# Altium project B9_HashBoard.PrjPcb (part 1 of 2)
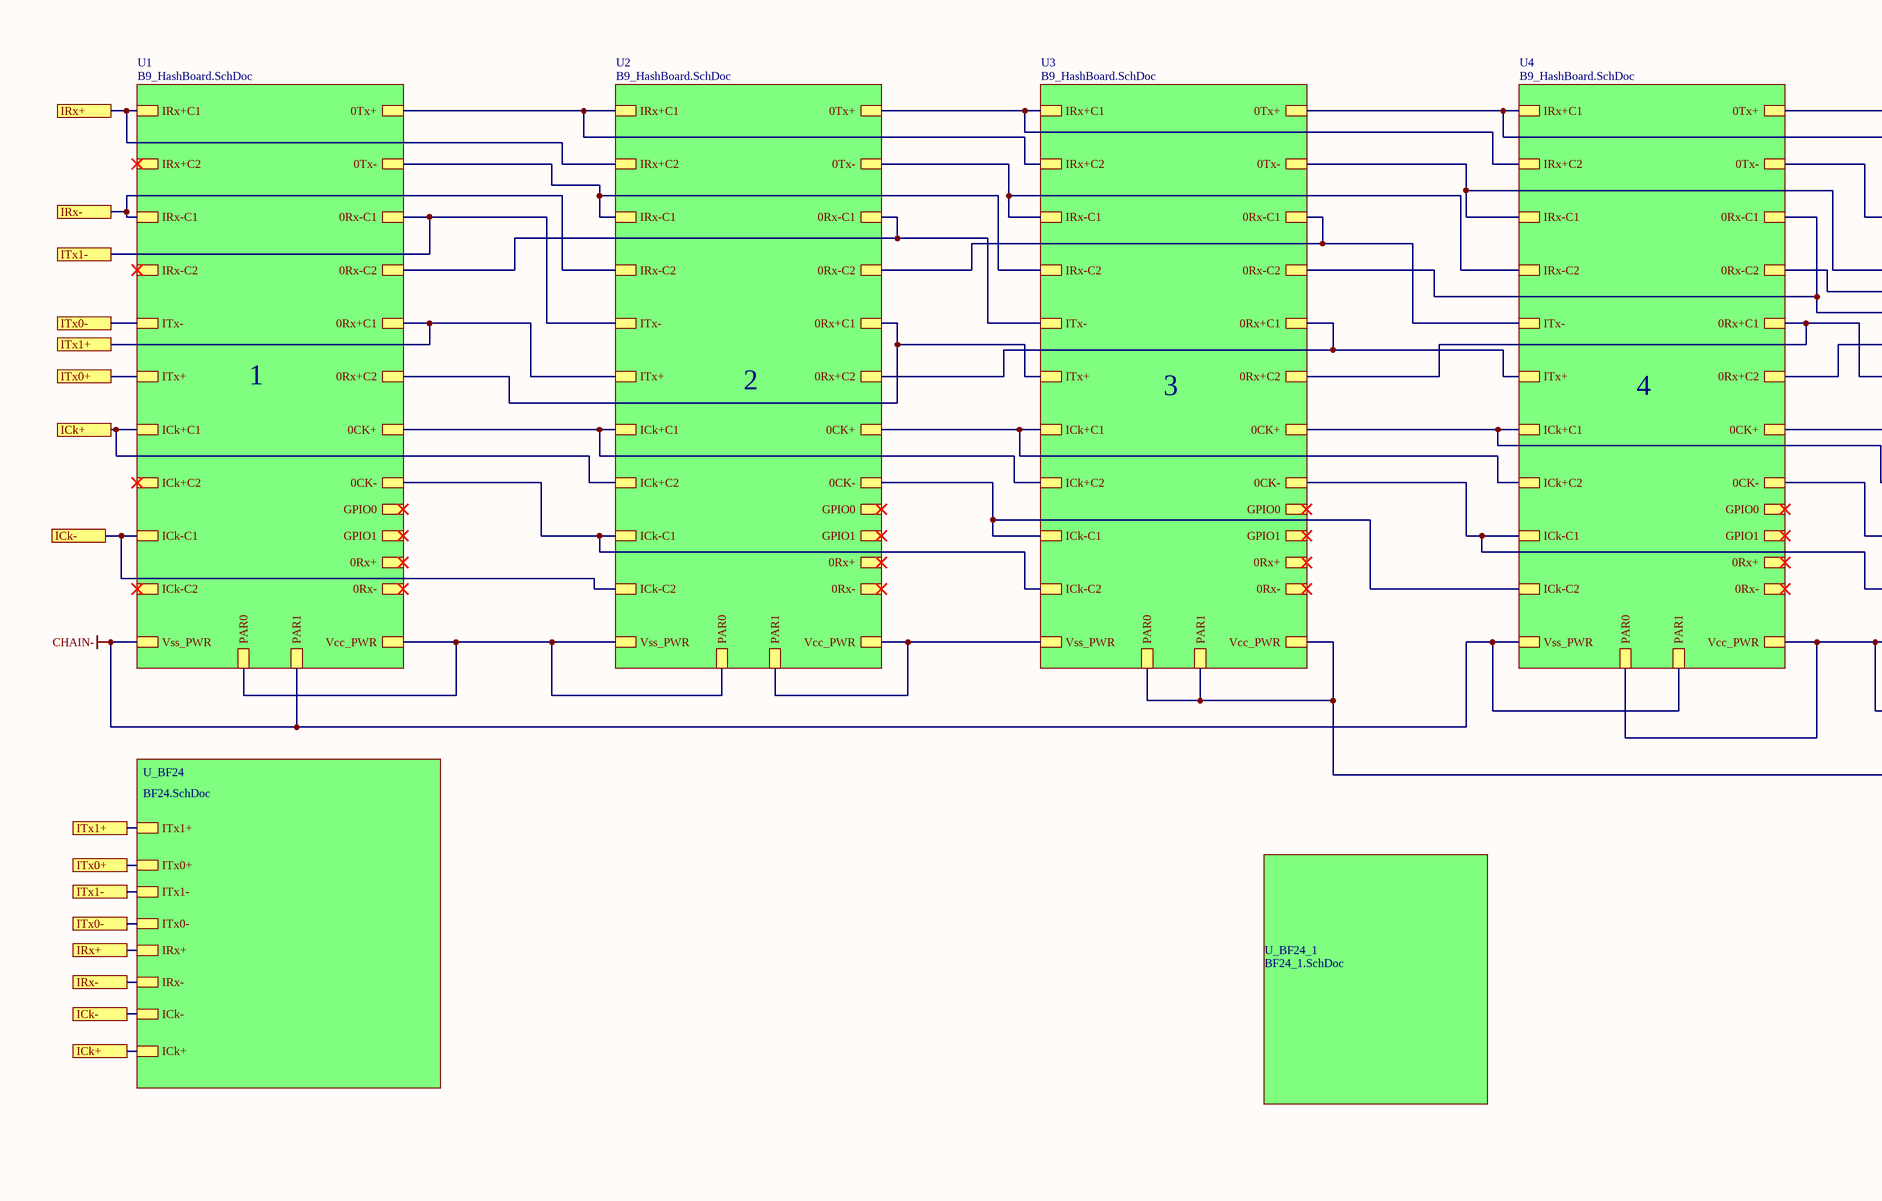
[diagram p0: Chain.SchDoc, top left]
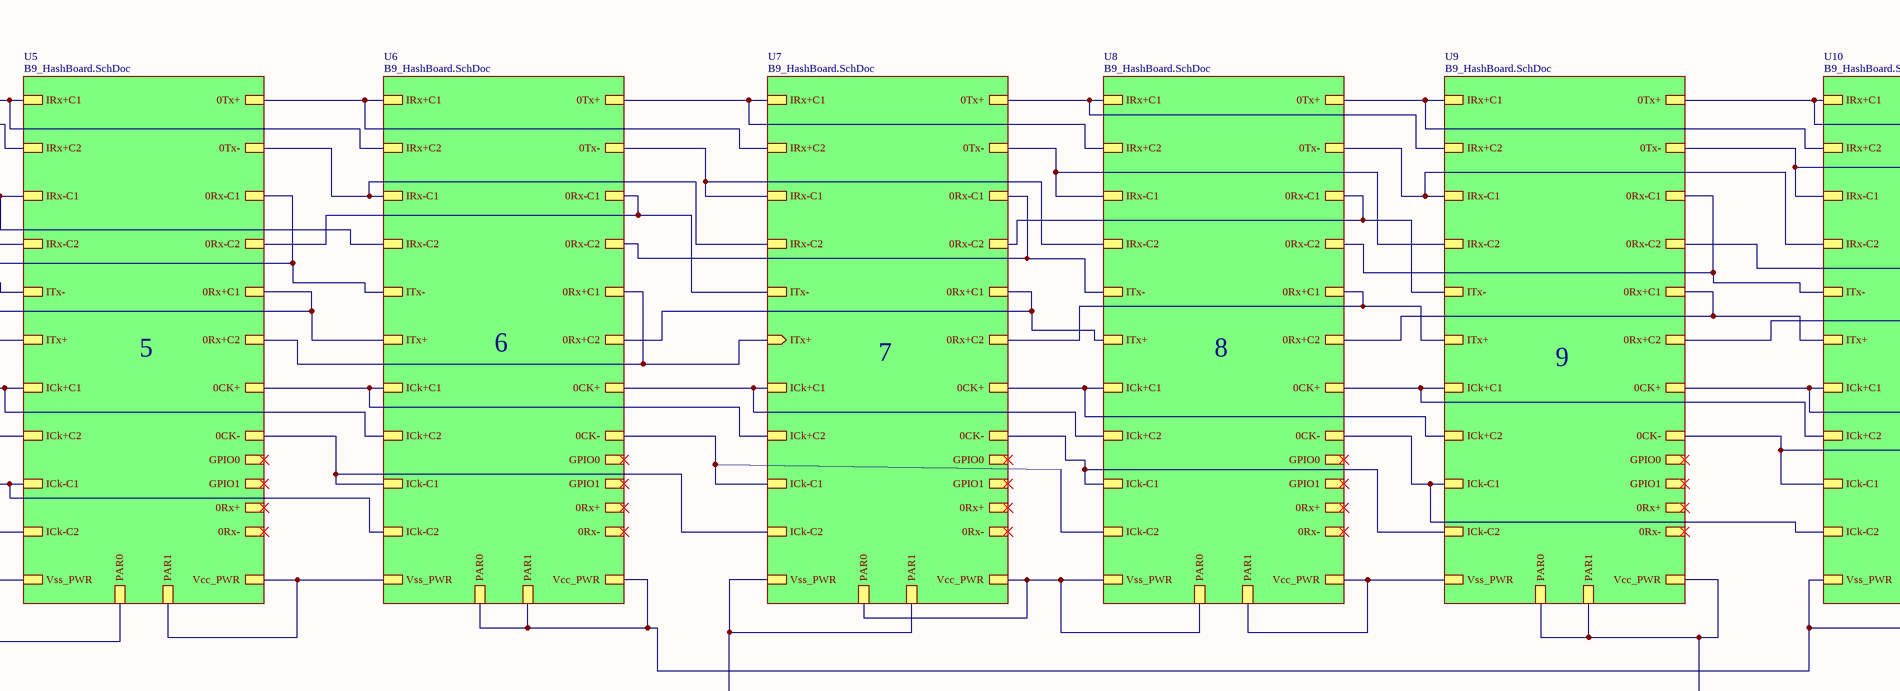
[diagram p1: Chain.SchDoc, top middle]
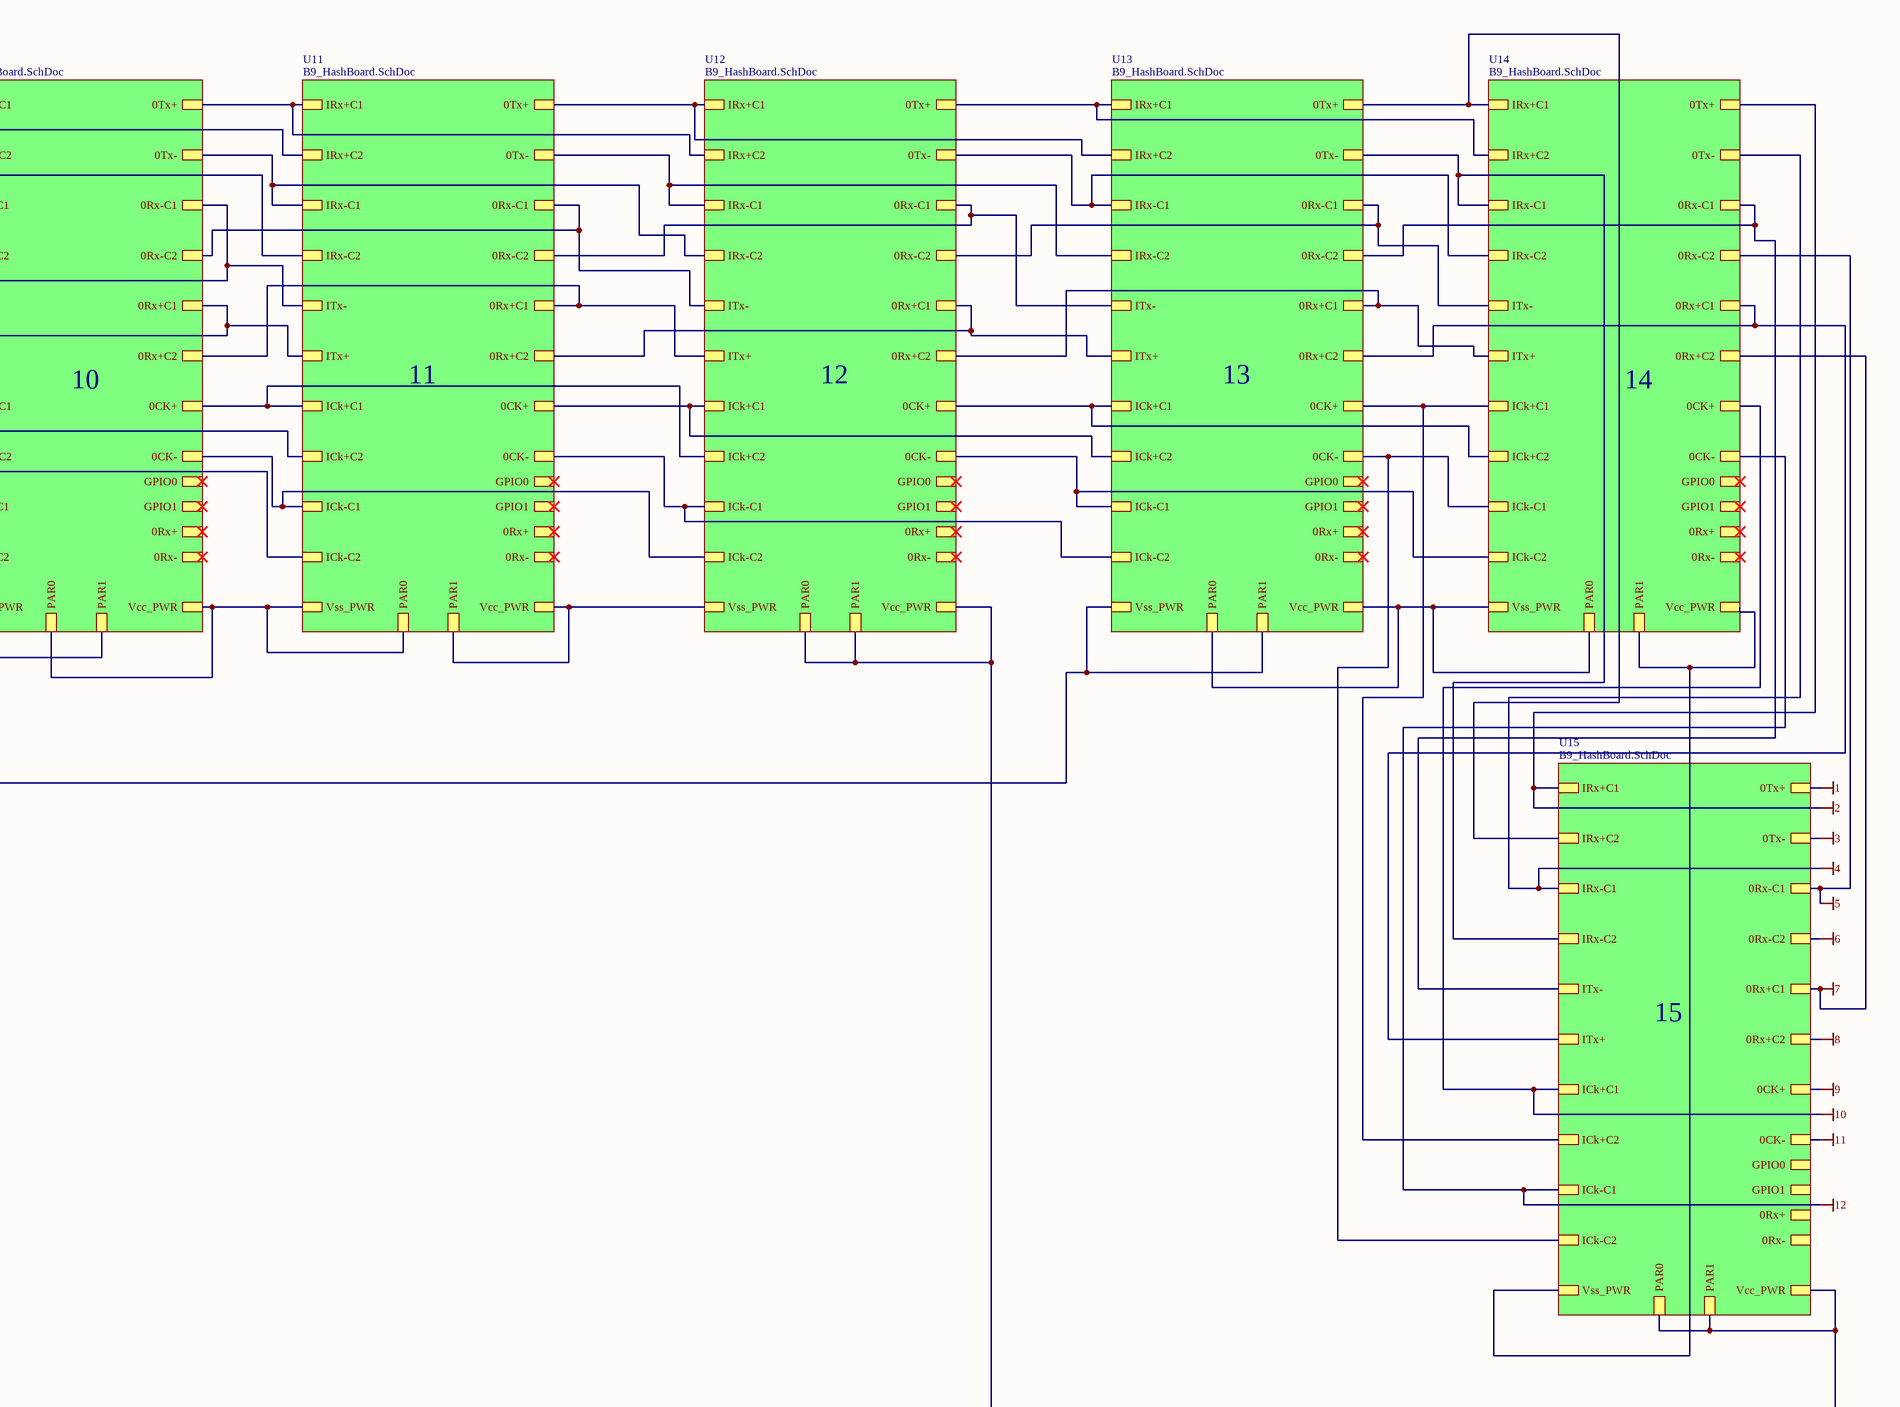
[diagram p2: Chain.SchDoc, top right]
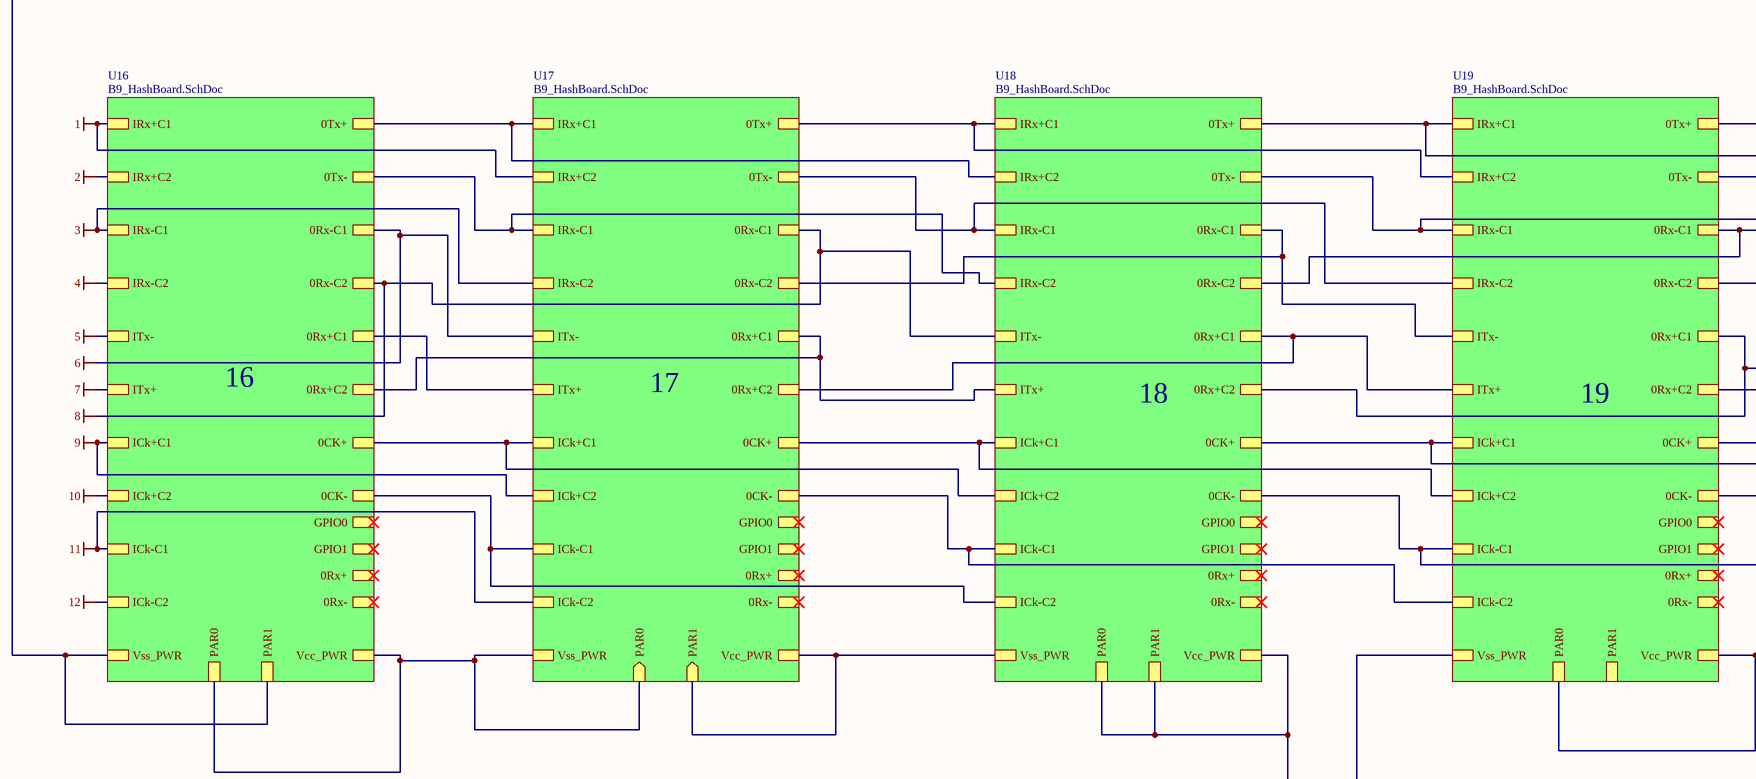
[diagram p3: Chain.SchDoc, bottom left]
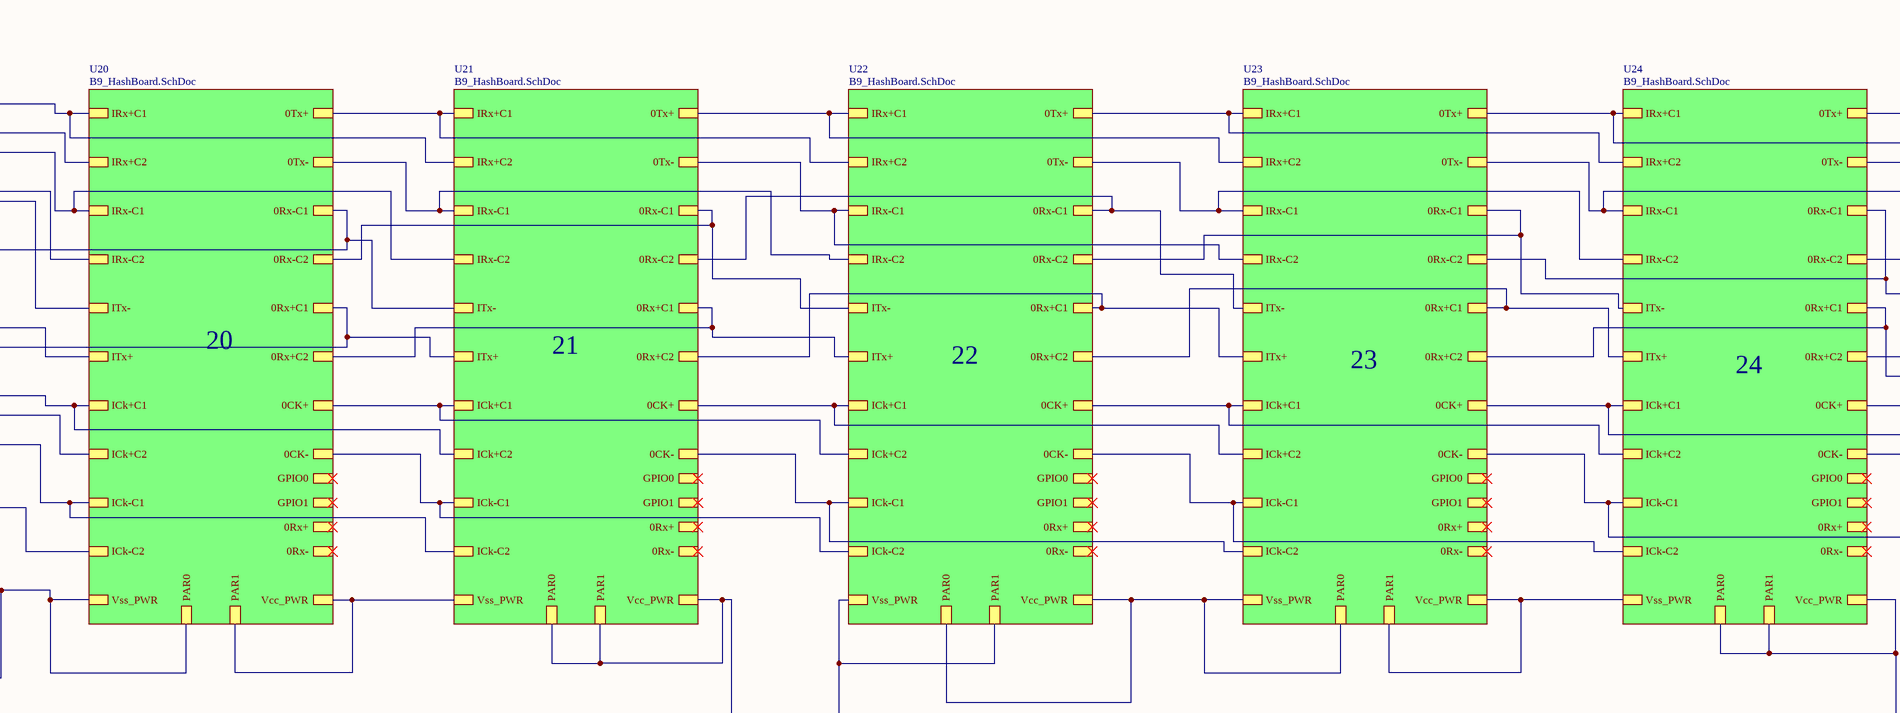
[diagram p4: Chain.SchDoc, bottom middle]
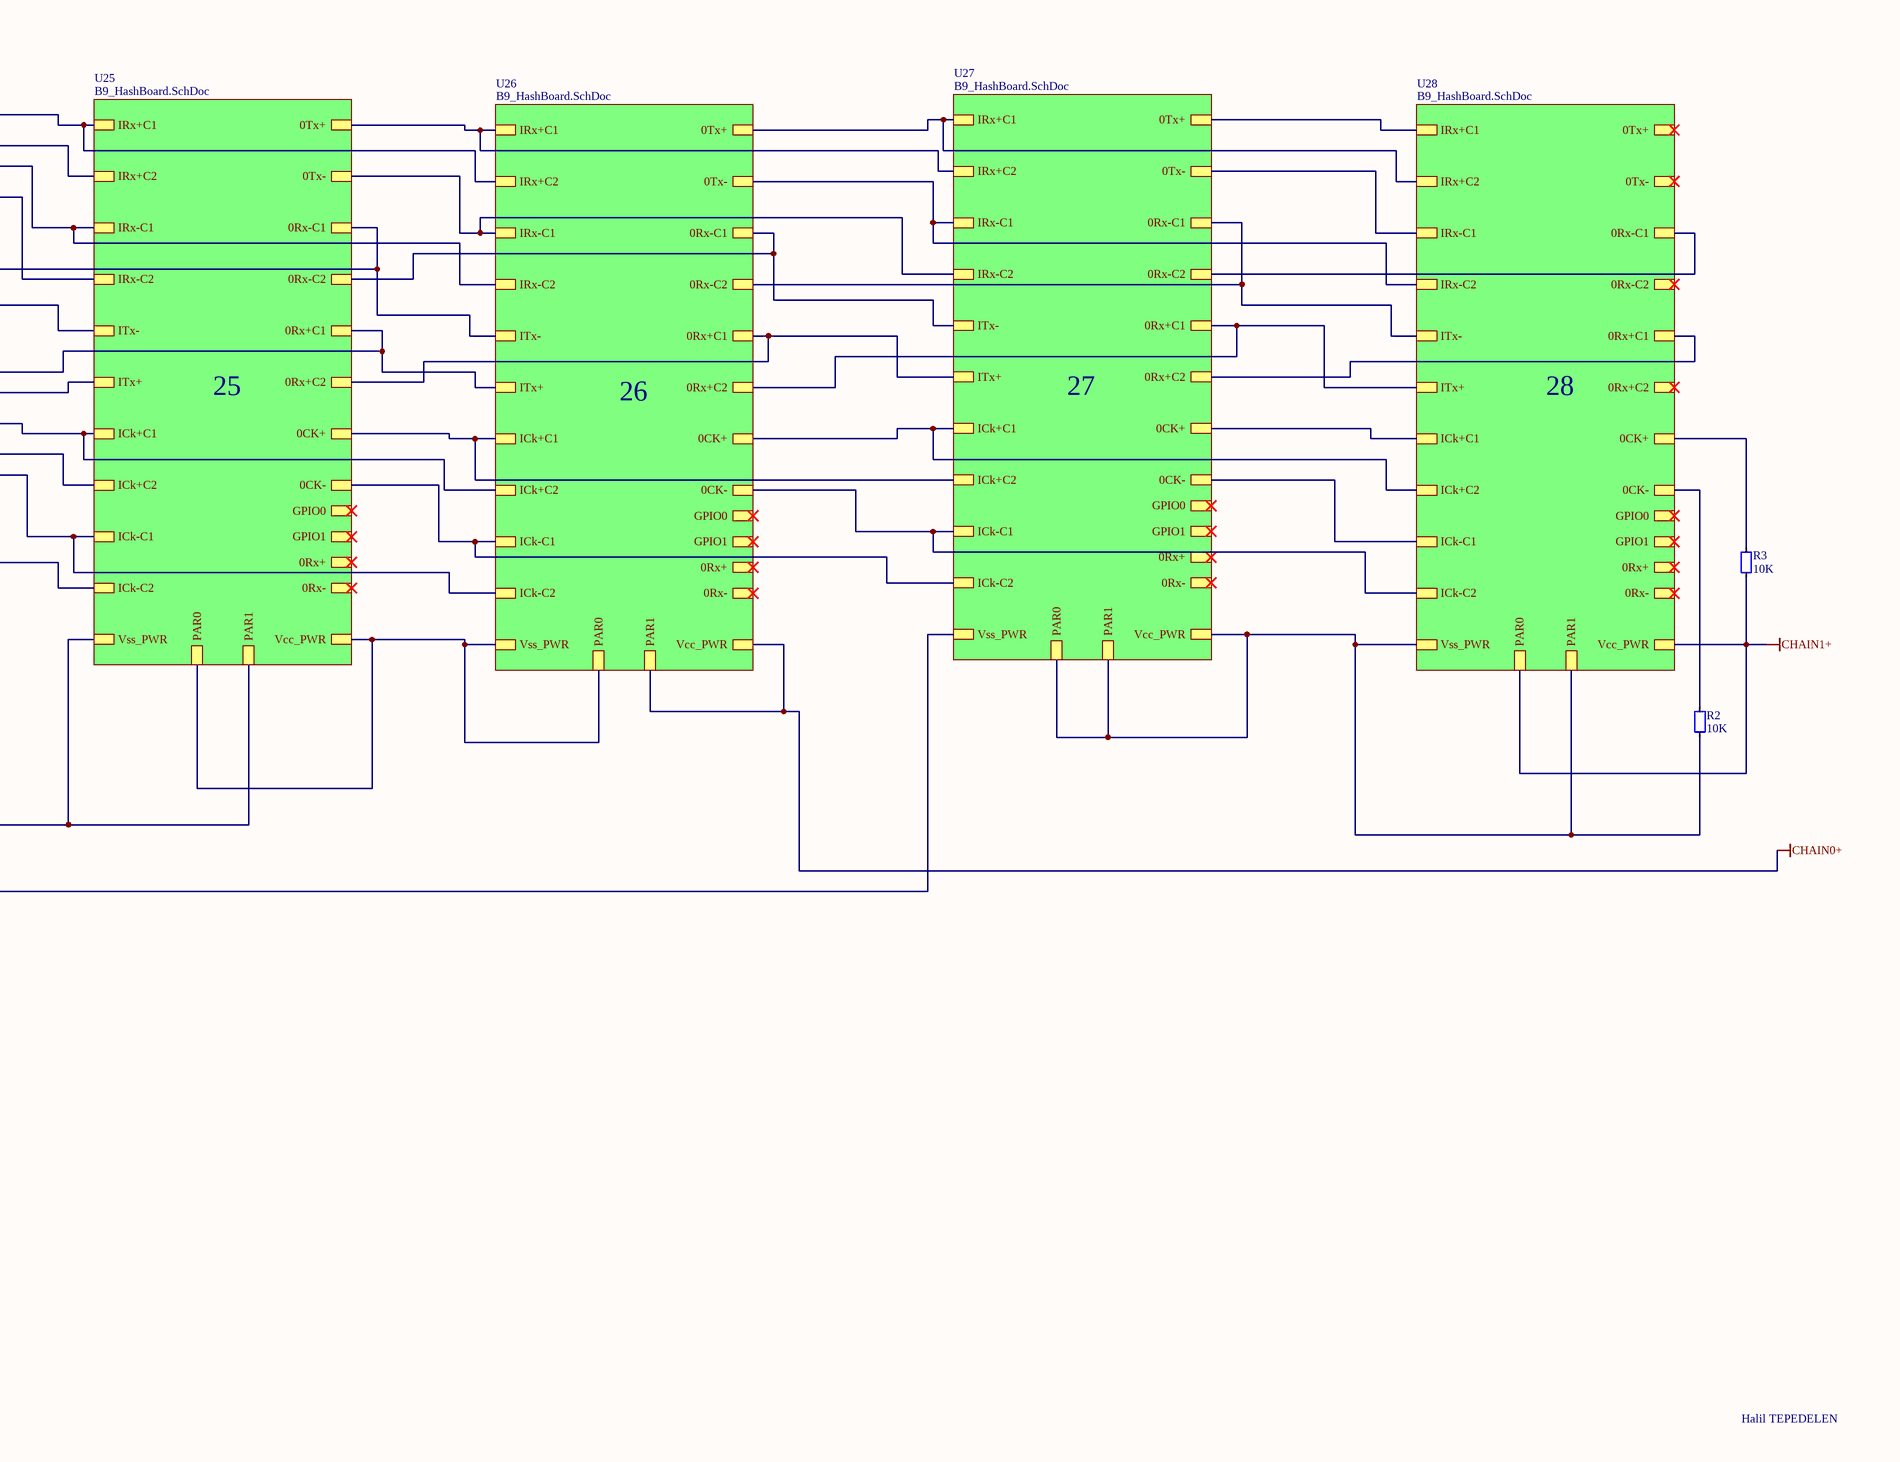
[diagram p5: Chain.SchDoc, bottom right]
4 sheets, 995 parts. Net scope: hierarchical (ports join the sheet entries above them; power ports are global).
Board file: B9_HashBoard.PcbDoc
Sheets:
  Chain.SchDoc
    U1 = B9_HashBoard.SchDoc
    U2 = B9_HashBoard.SchDoc
    U3 = B9_HashBoard.SchDoc
    U4 = B9_HashBoard.SchDoc
    U5 = B9_HashBoard.SchDoc
    U6 = B9_HashBoard.SchDoc
    U7 = B9_HashBoard.SchDoc
    U8 = B9_HashBoard.SchDoc
    U9 = B9_HashBoard.SchDoc
    U10 = B9_HashBoard.SchDoc
    U11 = B9_HashBoard.SchDoc
    U12 = B9_HashBoard.SchDoc
    U13 = B9_HashBoard.SchDoc
    U14 = B9_HashBoard.SchDoc
    U15 = B9_HashBoard.SchDoc
    U16 = B9_HashBoard.SchDoc
    U17 = B9_HashBoard.SchDoc
    U18 = B9_HashBoard.SchDoc
    U19 = B9_HashBoard.SchDoc
    U20 = B9_HashBoard.SchDoc
    U21 = B9_HashBoard.SchDoc
    U22 = B9_HashBoard.SchDoc
    U23 = B9_HashBoard.SchDoc
    U24 = B9_HashBoard.SchDoc
    U25 = B9_HashBoard.SchDoc
    U26 = B9_HashBoard.SchDoc
    U27 = B9_HashBoard.SchDoc
    U28 = B9_HashBoard.SchDoc
    U_BF24_1 = BF24_1.SchDoc
    U_BF24 = BF24.SchDoc

## Sheet Chain.SchDoc
size A0

### Parts
R2  10K  [R-0402R]
R3  10K  [R-0402R]

### Sub-sheets
U1 = B9_HashBoard.SchDoc: Vcc_PWR, Vss_PWR, 0Rx+, 0Rx-, 0Rx+C1, 0Rx-C1, 0Rx+C2, 0Rx-C2, 0Tx+, 0Tx-, 0CK+, 0CK-, ICk-C1, ICk+C1, IRx-C1, IRx+C1, ITx-, ITx+, IRx-C2, IRx+C2, ICk-C2, ICk+C2, PAR0, PAR1, GPIO0, GPIO1
U2 = B9_HashBoard.SchDoc: Vcc_PWR, Vss_PWR, 0Rx+, 0Rx-, 0Rx+C1, 0Rx-C1, 0Rx+C2, 0Rx-C2, 0Tx+, 0Tx-, 0CK+, 0CK-, ICk-C1, ICk+C1, IRx-C1, IRx+C1, ITx-, ITx+, IRx-C2, IRx+C2, ICk-C2, ICk+C2, PAR0, PAR1, GPIO0, GPIO1
U3 = B9_HashBoard.SchDoc: Vcc_PWR, Vss_PWR, 0Rx+, 0Rx-, 0Rx+C1, 0Rx-C1, 0Rx+C2, 0Rx-C2, 0Tx+, 0Tx-, 0CK+, 0CK-, ICk-C1, ICk+C1, IRx-C1, IRx+C1, ITx-, ITx+, IRx-C2, IRx+C2, ICk-C2, ICk+C2, PAR0, PAR1, GPIO0, GPIO1
U4 = B9_HashBoard.SchDoc: Vcc_PWR, Vss_PWR, 0Rx+, 0Rx-, 0Rx+C1, 0Rx-C1, 0Rx+C2, 0Rx-C2, 0Tx+, 0Tx-, 0CK+, 0CK-, ICk-C1, ICk+C1, IRx-C1, IRx+C1, ITx-, ITx+, IRx-C2, IRx+C2, ICk-C2, ICk+C2, PAR0, PAR1, GPIO0, GPIO1
U5 = B9_HashBoard.SchDoc: Vcc_PWR, Vss_PWR, 0Rx+, 0Rx-, 0Rx+C1, 0Rx-C1, 0Rx+C2, 0Rx-C2, 0Tx+, 0Tx-, 0CK+, 0CK-, ICk-C1, ICk+C1, IRx-C1, IRx+C1, ITx-, ITx+, IRx-C2, IRx+C2, ICk-C2, ICk+C2, PAR0, PAR1, GPIO0, GPIO1
U6 = B9_HashBoard.SchDoc: Vcc_PWR, Vss_PWR, 0Rx+, 0Rx-, 0Rx+C1, 0Rx-C1, 0Rx+C2, 0Rx-C2, 0Tx+, 0Tx-, 0CK+, 0CK-, ICk-C1, ICk+C1, IRx-C1, IRx+C1, ITx-, ITx+, IRx-C2, IRx+C2, ICk-C2, ICk+C2, PAR0, PAR1, GPIO0, GPIO1
U7 = B9_HashBoard.SchDoc: Vcc_PWR, Vss_PWR, 0Rx+, 0Rx-, 0Rx+C1, 0Rx-C1, 0Rx+C2, 0Rx-C2, 0Tx+, 0Tx-, 0CK+, 0CK-, ICk-C1, ICk+C1, IRx-C1, IRx+C1, ITx-, ITx+ (in), IRx-C2, IRx+C2, ICk-C2, ICk+C2, PAR0, PAR1, GPIO0, GPIO1
U8 = B9_HashBoard.SchDoc: Vcc_PWR, Vss_PWR, 0Rx+, 0Rx-, 0Rx+C1, 0Rx-C1, 0Rx+C2, 0Rx-C2, 0Tx+, 0Tx-, 0CK+, 0CK-, ICk-C1, ICk+C1, IRx-C1, IRx+C1, ITx-, ITx+, IRx-C2, IRx+C2, ICk-C2, ICk+C2, PAR0, PAR1, GPIO0, GPIO1
U9 = B9_HashBoard.SchDoc: Vcc_PWR, Vss_PWR, 0Rx+, 0Rx-, 0Rx+C1, 0Rx-C1, 0Rx+C2, 0Rx-C2, 0Tx+, 0Tx-, 0CK+, 0CK-, ICk-C1, ICk+C1, IRx-C1, IRx+C1, ITx-, ITx+, IRx-C2, IRx+C2, ICk-C2, ICk+C2, PAR0, PAR1, GPIO0, GPIO1
U10 = B9_HashBoard.SchDoc: Vcc_PWR, Vss_PWR, 0Rx+, 0Rx-, 0Rx+C1, 0Rx-C1, 0Rx+C2, 0Rx-C2, 0Tx+, 0Tx-, 0CK+, 0CK-, ICk-C1, ICk+C1, IRx-C1, IRx+C1, ITx-, ITx+, IRx-C2, IRx+C2, ICk-C2, ICk+C2, PAR0, PAR1, GPIO0, GPIO1
U11 = B9_HashBoard.SchDoc: Vcc_PWR, Vss_PWR, 0Rx+, 0Rx-, 0Rx+C1, 0Rx-C1, 0Rx+C2, 0Rx-C2, 0Tx+, 0Tx-, 0CK+, 0CK-, ICk-C1, ICk+C1, IRx-C1, IRx+C1, ITx-, ITx+, IRx-C2, IRx+C2, ICk-C2, ICk+C2, PAR0, PAR1, GPIO0, GPIO1
U12 = B9_HashBoard.SchDoc: Vcc_PWR, Vss_PWR, 0Rx+, 0Rx-, 0Rx+C1, 0Rx-C1, 0Rx+C2, 0Rx-C2, 0Tx+, 0Tx-, 0CK+, 0CK-, ICk-C1, ICk+C1, IRx-C1, IRx+C1, ITx-, ITx+, IRx-C2, IRx+C2, ICk-C2, ICk+C2, PAR0, PAR1, GPIO0, GPIO1
U13 = B9_HashBoard.SchDoc: Vcc_PWR, Vss_PWR, 0Rx+, 0Rx-, 0Rx+C1, 0Rx-C1, 0Rx+C2, 0Rx-C2, 0Tx+, 0Tx-, 0CK+, 0CK-, ICk-C1, ICk+C1, IRx-C1, IRx+C1, ITx-, ITx+, IRx-C2, IRx+C2, ICk-C2, ICk+C2, PAR0, PAR1, GPIO0, GPIO1
U14 = B9_HashBoard.SchDoc: Vcc_PWR, Vss_PWR, 0Rx+, 0Rx-, 0Rx+C1, 0Rx-C1, 0Rx+C2, 0Rx-C2, 0Tx+, 0Tx-, 0CK+, 0CK-, ICk-C1, ICk+C1, IRx-C1, IRx+C1, ITx-, ITx+, IRx-C2, IRx+C2, ICk-C2, ICk+C2, PAR0, PAR1, GPIO0, GPIO1
U15 = B9_HashBoard.SchDoc: Vcc_PWR, Vss_PWR, 0Rx+, 0Rx-, 0Rx+C1, 0Rx-C1, 0Rx+C2, 0Rx-C2, 0Tx+, 0Tx-, 0CK+, 0CK-, ICk-C1, ICk+C1, IRx-C1, IRx+C1, ITx-, ITx+, IRx-C2, IRx+C2, ICk-C2, ICk+C2, PAR0, PAR1, GPIO0, GPIO1
U16 = B9_HashBoard.SchDoc: Vcc_PWR, Vss_PWR, 0Rx+, 0Rx-, 0Rx+C1, 0Rx-C1, 0Rx+C2, 0Rx-C2, 0Tx+, 0Tx-, 0CK+, 0CK-, ICk-C1, ICk+C1, IRx-C1, IRx+C1, ITx-, ITx+, IRx-C2, IRx+C2, ICk-C2, ICk+C2, PAR0, PAR1, GPIO0, GPIO1
U17 = B9_HashBoard.SchDoc: Vcc_PWR, Vss_PWR, 0Rx+, 0Rx-, 0Rx+C1, 0Rx-C1, 0Rx+C2, 0Rx-C2, 0Tx+, 0Tx-, 0CK+, 0CK-, ICk-C1, ICk+C1, IRx-C1, IRx+C1, ITx-, ITx+, IRx-C2, IRx+C2, ICk-C2, ICk+C2, PAR0 (in), PAR1 (in), GPIO0, GPIO1
U18 = B9_HashBoard.SchDoc: Vcc_PWR, Vss_PWR, 0Rx+, 0Rx-, 0Rx+C1, 0Rx-C1, 0Rx+C2, 0Rx-C2, 0Tx+, 0Tx-, 0CK+, 0CK-, ICk-C1, ICk+C1, IRx-C1, IRx+C1, ITx-, ITx+, IRx-C2, IRx+C2, ICk-C2, ICk+C2, PAR0, PAR1, GPIO0, GPIO1
U19 = B9_HashBoard.SchDoc: Vcc_PWR, Vss_PWR, 0Rx+, 0Rx-, 0Rx+C1, 0Rx-C1, 0Rx+C2, 0Rx-C2, 0Tx+, 0Tx-, 0CK+, 0CK-, ICk-C1, ICk+C1, IRx-C1, IRx+C1, ITx-, ITx+, IRx-C2, IRx+C2, ICk-C2, ICk+C2, PAR0, PAR1, GPIO0, GPIO1
U20 = B9_HashBoard.SchDoc: Vcc_PWR, Vss_PWR, 0Rx+, 0Rx-, 0Rx+C1, 0Rx-C1, 0Rx+C2, 0Rx-C2, 0Tx+, 0Tx-, 0CK+, 0CK-, ICk-C1, ICk+C1, IRx-C1, IRx+C1, ITx-, ITx+, IRx-C2, IRx+C2, ICk-C2, ICk+C2, PAR0, PAR1, GPIO0, GPIO1
U21 = B9_HashBoard.SchDoc: Vcc_PWR, Vss_PWR, 0Rx+, 0Rx-, 0Rx+C1, 0Rx-C1, 0Rx+C2, 0Rx-C2, 0Tx+, 0Tx-, 0CK+, 0CK-, ICk-C1, ICk+C1, IRx-C1, IRx+C1, ITx-, ITx+, IRx-C2, IRx+C2, ICk-C2, ICk+C2, PAR0, PAR1, GPIO0, GPIO1
U22 = B9_HashBoard.SchDoc: Vcc_PWR, Vss_PWR, 0Rx+, 0Rx-, 0Rx+C1, 0Rx-C1, 0Rx+C2, 0Rx-C2, 0Tx+, 0Tx-, 0CK+, 0CK-, ICk-C1, ICk+C1, IRx-C1, IRx+C1, ITx-, ITx+, IRx-C2, IRx+C2, ICk-C2, ICk+C2, PAR0, PAR1, GPIO0, GPIO1
U23 = B9_HashBoard.SchDoc: Vcc_PWR, Vss_PWR, 0Rx+, 0Rx-, 0Rx+C1, 0Rx-C1, 0Rx+C2, 0Rx-C2, 0Tx+, 0Tx-, 0CK+, 0CK-, ICk-C1, ICk+C1, IRx-C1, IRx+C1, ITx-, ITx+, IRx-C2, IRx+C2, ICk-C2, ICk+C2, PAR0, PAR1, GPIO0, GPIO1
U24 = B9_HashBoard.SchDoc: Vcc_PWR, Vss_PWR, 0Rx+, 0Rx-, 0Rx+C1, 0Rx-C1, 0Rx+C2, 0Rx-C2, 0Tx+, 0Tx-, 0CK+, 0CK-, ICk-C1, ICk+C1, IRx-C1, IRx+C1, ITx-, ITx+, IRx-C2, IRx+C2, ICk-C2, ICk+C2, PAR0, PAR1, GPIO0, GPIO1
U25 = B9_HashBoard.SchDoc: Vcc_PWR, Vss_PWR, 0Rx+, 0Rx-, 0Rx+C1, 0Rx-C1, 0Rx+C2, 0Rx-C2, 0Tx+, 0Tx-, 0CK+, 0CK-, ICk-C1, ICk+C1, IRx-C1, IRx+C1, ITx-, ITx+, IRx-C2, IRx+C2, ICk-C2, ICk+C2, PAR0, PAR1, GPIO0, GPIO1
U26 = B9_HashBoard.SchDoc: Vcc_PWR, Vss_PWR, 0Rx+, 0Rx-, 0Rx+C1, 0Rx-C1, 0Rx+C2, 0Rx-C2, 0Tx+, 0Tx-, 0CK+, 0CK-, ICk-C1, ICk+C1, IRx-C1, IRx+C1, ITx-, ITx+, IRx-C2, IRx+C2, ICk-C2, ICk+C2, PAR0, PAR1, GPIO0, GPIO1
U27 = B9_HashBoard.SchDoc: Vcc_PWR, Vss_PWR, 0Rx+, 0Rx-, 0Rx+C1, 0Rx-C1, 0Rx+C2, 0Rx-C2, 0Tx+, 0Tx-, 0CK+, 0CK-, ICk-C1, ICk+C1, IRx-C1, IRx+C1, ITx-, ITx+, IRx-C2, IRx+C2, ICk-C2, ICk+C2, PAR0, PAR1, GPIO0, GPIO1
U28 = B9_HashBoard.SchDoc: Vcc_PWR, Vss_PWR, 0Rx+, 0Rx-, 0Rx+C1, 0Rx-C1, 0Rx+C2, 0Rx-C2, 0Tx+, 0Tx-, 0CK+, 0CK-, ICk-C1, ICk+C1, IRx-C1, IRx+C1, ITx-, ITx+, IRx-C2, IRx+C2, ICk-C2, ICk+C2, PAR0, PAR1, GPIO0, GPIO1
U_BF24 = BF24.SchDoc: ITx1+, ITx0+, ITx1-, ITx0-, IRx+, IRx-, ICk-, ICk+
U_BF24_1 = BF24_1.SchDoc: no entries

### Ports
ICk+, ICk-, IRx+, IRx-, ITx0+, ITx0-, ITx1+, ITx1-

### Nets
1: sheet U15/0Tx+, sheet U16/IRx+C1, sheet U17/IRx+C2
2: sheet U14/0Tx+, sheet U15/IRx+C1, sheet U16/IRx+C2
3: sheet U15/0Tx-, sheet U16/IRx-C1, sheet U17/IRx-C2
4: sheet U14/0Tx-, sheet U15/IRx-C1, sheet U16/IRx-C2
5: sheet U14/0Rx-C2, sheet U15/0Rx-C1, sheet U16/ITx-
6: sheet U15/0Rx-C2, sheet U16/0Rx-C1, sheet U17/ITx-
7: sheet U14/0Rx+C2, sheet U15/0Rx+C1, sheet U16/ITx+
8: sheet U15/0Rx+C2, sheet U16/0Rx-C2, sheet U17/0Rx-C1, sheet U18/ITx-
9: sheet U15/0CK+, sheet U16/ICk+C1, sheet U17/ICk+C2
10: sheet U14/0CK+, sheet U15/ICk+C1, sheet U16/ICk+C2
11: sheet U15/0CK-, sheet U16/ICk-C1, sheet U17/ICk-C2
12: sheet U14/0CK-, sheet U15/ICk-C1, sheet U16/ICk-C2
CHAIN-: R2.1 R3.1 ; sheet U1/Vcc_PWR, sheet U1/Vss_PWR, sheet U1/PAR0, sheet U1/PAR1, sheet U2/Vcc_PWR, sheet U2/Vss_PWR, sheet U2/PAR0, sheet U2/PAR1, sheet U3/Vcc_PWR, sheet U3/Vss_PWR, sheet U3/PAR0, sheet U3/PAR1, sheet U4/Vcc_PWR, sheet U4/Vss_PWR, sheet U4/PAR0, sheet U4/PAR1, sheet U5/Vcc_PWR, sheet U5/Vss_PWR, sheet U5/PAR0, sheet U5/PAR1, sheet U6/Vcc_PWR, sheet U6/Vss_PWR, sheet U6/PAR0, sheet U6/PAR1, sheet U7/Vcc_PWR, sheet U7/Vss_PWR, sheet U7/PAR0, sheet U7/PAR1, sheet U8/Vcc_PWR, sheet U8/Vss_PWR, sheet U8/PAR0, sheet U8/PAR1, sheet U9/Vcc_PWR, sheet U9/Vss_PWR, sheet U9/PAR0, sheet U9/PAR1, sheet U10/Vcc_PWR, sheet U10/Vss_PWR, sheet U10/PAR0, sheet U10/PAR1, sheet U11/Vcc_PWR, sheet U11/Vss_PWR, sheet U11/PAR0, sheet U11/PAR1, sheet U12/Vcc_PWR, sheet U12/Vss_PWR, sheet U12/PAR0, sheet U12/PAR1, sheet U13/Vcc_PWR, sheet U13/Vss_PWR, sheet U13/PAR0, sheet U13/PAR1, sheet U14/Vcc_PWR, sheet U14/Vss_PWR, sheet U14/PAR0, sheet U14/PAR1, sheet U15/Vcc_PWR, sheet U15/Vss_PWR, sheet U15/PAR0, sheet U15/PAR1, sheet U16/Vcc_PWR, sheet U16/Vss_PWR, sheet U16/PAR0, sheet U16/PAR1, sheet U17/Vcc_PWR, sheet U17/Vss_PWR, sheet U17/PAR0, sheet U17/PAR1, sheet U18/Vcc_PWR, sheet U18/Vss_PWR, sheet U18/PAR0, sheet U18/PAR1, sheet U19/Vcc_PWR, sheet U19/Vss_PWR, sheet U19/PAR0, sheet U19/PAR1, sheet U20/Vcc_PWR, sheet U20/Vss_PWR, sheet U20/PAR0, sheet U20/PAR1, sheet U21/Vcc_PWR, sheet U21/Vss_PWR, sheet U21/PAR0, sheet U21/PAR1, sheet U22/Vcc_PWR, sheet U22/Vss_PWR, sheet U22/PAR0, sheet U22/PAR1, sheet U23/Vcc_PWR, sheet U23/Vss_PWR, sheet U23/PAR0, sheet U23/PAR1, sheet U24/Vcc_PWR, sheet U24/Vss_PWR, sheet U24/PAR0, sheet U24/PAR1, sheet U25/Vcc_PWR, sheet U25/Vss_PWR, sheet U25/PAR0, sheet U25/PAR1, sheet U26/Vcc_PWR, sheet U26/Vss_PWR, sheet U26/PAR0, sheet U26/PAR1, sheet U27/Vcc_PWR, sheet U27/Vss_PWR, sheet U27/PAR0, sheet U27/PAR1, sheet U28/Vcc_PWR, sheet U28/Vss_PWR, sheet U28/PAR0, sheet U28/PAR1  [also labelled CHAIN0+, CHAIN1+]
GPIO0: sheet U1/GPIO0, sheet U2/GPIO0, sheet U3/GPIO0, sheet U4/GPIO0, sheet U5/GPIO0, sheet U6/GPIO0, sheet U7/GPIO0, sheet U8/GPIO0, sheet U9/GPIO0, sheet U10/GPIO0, sheet U11/GPIO0, sheet U12/GPIO0, sheet U13/GPIO0, sheet U14/GPIO0, sheet U15/GPIO0, sheet U16/GPIO0, sheet U17/GPIO0, sheet U18/GPIO0, sheet U19/GPIO0, sheet U20/GPIO0, sheet U21/GPIO0, sheet U22/GPIO0, sheet U23/GPIO0, sheet U24/GPIO0, sheet U25/GPIO0, sheet U26/GPIO0, sheet U27/GPIO0, sheet U28/GPIO0
GPIO1: sheet U1/GPIO1, sheet U2/GPIO1, sheet U3/GPIO1, sheet U4/GPIO1, sheet U5/GPIO1, sheet U6/GPIO1, sheet U7/GPIO1, sheet U8/GPIO1, sheet U9/GPIO1, sheet U10/GPIO1, sheet U11/GPIO1, sheet U12/GPIO1, sheet U13/GPIO1, sheet U14/GPIO1, sheet U15/GPIO1, sheet U16/GPIO1, sheet U17/GPIO1, sheet U18/GPIO1, sheet U19/GPIO1, sheet U20/GPIO1, sheet U21/GPIO1, sheet U22/GPIO1, sheet U23/GPIO1, sheet U24/GPIO1, sheet U25/GPIO1, sheet U26/GPIO1, sheet U27/GPIO1, sheet U28/GPIO1
ICk+: port ICk+, sheet U1/ICk+C1, sheet U2/ICk+C2, sheet U_BF24/ICk+
ICk-: port ICk-, sheet U1/ICk-C1, sheet U2/ICk-C2, sheet U_BF24/ICk-
IRx+: port IRx+, sheet U1/IRx+C1, sheet U2/IRx+C2, sheet U_BF24/IRx+
IRx-: port IRx-, sheet U1/IRx-C1, sheet U2/IRx-C2, sheet U_BF24/IRx-
NetC1_U1_1: port ITx1+, sheet U1/0Rx+C1, sheet U2/ITx+, sheet U_BF24/ITx1+
NetC1_U2_1: sheet U1/0Rx+C2, sheet U2/0Rx+C1, sheet U3/ITx+
NetC1_U3_1: sheet U2/0Rx+C2, sheet U3/0Rx+C1, sheet U4/ITx+
NetC1_U4_1: sheet U3/0Rx+C2, sheet U4/0Rx+C1, sheet U5/ITx+
NetC1_U5_1: sheet U4/0Rx+C2, sheet U5/0Rx+C1, sheet U6/ITx+
NetC1_U6_1: sheet U5/0Rx+C2, sheet U6/0Rx+C1, sheet U7/ITx+
NetC1_U7_1: sheet U6/0Rx+C2, sheet U7/0Rx+C1, sheet U8/ITx+
NetC1_U8_1: sheet U7/0Rx+C2, sheet U8/0Rx+C1, sheet U9/ITx+
NetC1_U9_1: sheet U8/0Rx+C2, sheet U9/0Rx+C1, sheet U10/ITx+
NetC1_U10_1: sheet U9/0Rx+C2, sheet U10/0Rx+C1, sheet U11/ITx+
NetC1_U11_1: sheet U10/0Rx+C2, sheet U11/0Rx+C1, sheet U12/ITx+
NetC1_U12_1: sheet U11/0Rx+C2, sheet U12/0Rx+C1, sheet U13/ITx+
NetC1_U13_1: sheet U12/0Rx+C2, sheet U13/0Rx+C1, sheet U14/ITx+
NetC1_U14_1: sheet U13/0Rx+C2, sheet U14/0Rx+C1, sheet U15/ITx+
NetC1_U16_1: sheet U16/0Rx+C1, sheet U17/ITx+
NetC1_U17_1: sheet U16/0Rx+C2, sheet U17/0Rx+C1, sheet U18/ITx+
NetC1_U18_1: sheet U17/0Rx+C2, sheet U18/0Rx+C1, sheet U19/ITx+
NetC1_U19_1: sheet U18/0Rx+C2, sheet U19/0Rx+C1, sheet U20/ITx+
NetC1_U20_1: sheet U19/0Rx+C2, sheet U20/0Rx+C1, sheet U21/ITx+
NetC1_U21_1: sheet U20/0Rx+C2, sheet U21/0Rx+C1, sheet U22/ITx+
NetC1_U22_1: sheet U21/0Rx+C2, sheet U22/0Rx+C1, sheet U23/ITx+
NetC1_U23_1: sheet U22/0Rx+C2, sheet U23/0Rx+C1, sheet U24/ITx+
NetC1_U24_1: sheet U23/0Rx+C2, sheet U24/0Rx+C1, sheet U25/ITx+
NetC1_U25_1: sheet U24/0Rx+C2, sheet U25/0Rx+C1, sheet U26/ITx+
NetC1_U26_1: sheet U25/0Rx+C2, sheet U26/0Rx+C1, sheet U27/ITx+
NetC1_U27_1: sheet U26/0Rx+C2, sheet U27/0Rx+C1, sheet U28/ITx+
NetC1_U28_1: sheet U27/0Rx+C2, sheet U28/0Rx+C1
NetC2_U1_1: port ITx1-, sheet U1/0Rx-C1, sheet U2/ITx-, sheet U_BF24/ITx1-
NetC2_U2_1: sheet U1/0Rx-C2, sheet U2/0Rx-C1, sheet U3/ITx-
NetC2_U3_1: sheet U2/0Rx-C2, sheet U3/0Rx-C1, sheet U4/ITx-
NetC2_U4_1: sheet U3/0Rx-C2, sheet U4/0Rx-C1, sheet U5/ITx-
NetC2_U5_1: sheet U4/0Rx-C2, sheet U5/0Rx-C1, sheet U6/ITx-
NetC2_U6_1: sheet U5/0Rx-C2, sheet U6/0Rx-C1, sheet U7/ITx-
NetC2_U7_1: sheet U6/0Rx-C2, sheet U7/0Rx-C1, sheet U8/ITx-
NetC2_U8_1: sheet U7/0Rx-C2, sheet U8/0Rx-C1, sheet U9/ITx-
NetC2_U9_1: sheet U8/0Rx-C2, sheet U9/0Rx-C1, sheet U10/ITx-
NetC2_U10_1: sheet U9/0Rx-C2, sheet U10/0Rx-C1, sheet U11/ITx-
NetC2_U11_1: sheet U10/0Rx-C2, sheet U11/0Rx-C1, sheet U12/ITx-
NetC2_U12_1: sheet U11/0Rx-C2, sheet U12/0Rx-C1, sheet U13/ITx-
NetC2_U13_1: sheet U12/0Rx-C2, sheet U13/0Rx-C1, sheet U14/ITx-
NetC2_U14_1: sheet U13/0Rx-C2, sheet U14/0Rx-C1, sheet U15/ITx-
NetC2_U18_1: sheet U17/0Rx-C2, sheet U18/0Rx-C1, sheet U19/ITx-
NetC2_U19_1: sheet U18/0Rx-C2, sheet U19/0Rx-C1, sheet U20/ITx-
NetC2_U20_1: sheet U19/0Rx-C2, sheet U20/0Rx-C1, sheet U21/ITx-
NetC2_U21_1: sheet U20/0Rx-C2, sheet U21/0Rx-C1, sheet U22/ITx-
NetC2_U22_1: sheet U21/0Rx-C2, sheet U22/0Rx-C1, sheet U23/ITx-
NetC2_U23_1: sheet U22/0Rx-C2, sheet U23/0Rx-C1, sheet U24/ITx-
NetC2_U24_1: sheet U23/0Rx-C2, sheet U24/0Rx-C1, sheet U25/ITx-
NetC2_U25_1: sheet U24/0Rx-C2, sheet U25/0Rx-C1, sheet U26/ITx-
NetC2_U26_1: sheet U25/0Rx-C2, sheet U26/0Rx-C1, sheet U27/ITx-
NetC2_U27_1: sheet U26/0Rx-C2, sheet U27/0Rx-C1, sheet U28/ITx-
NetC2_U28_1: sheet U27/0Rx-C2, sheet U28/0Rx-C1
NetC5_U2_1: sheet U1/0CK-, sheet U2/ICk-C1, sheet U3/ICk-C2
NetC5_U3_1: sheet U2/0CK-, sheet U3/ICk-C1, sheet U4/ICk-C2
NetC5_U4_1: sheet U3/0CK-, sheet U4/ICk-C1, sheet U5/ICk-C2
NetC5_U5_1: sheet U4/0CK-, sheet U5/ICk-C1, sheet U6/ICk-C2
NetC5_U6_1: sheet U5/0CK-, sheet U6/ICk-C1, sheet U7/ICk-C2
NetC5_U7_1: sheet U6/0CK-, sheet U7/ICk-C1, sheet U8/ICk-C2
NetC5_U8_1: sheet U7/0CK-, sheet U8/ICk-C1, sheet U9/ICk-C2
NetC5_U9_1: sheet U8/0CK-, sheet U9/ICk-C1, sheet U10/ICk-C2
NetC5_U10_1: sheet U9/0CK-, sheet U10/ICk-C1, sheet U11/ICk-C2
NetC5_U11_1: sheet U10/0CK-, sheet U11/ICk-C1, sheet U12/ICk-C2
NetC5_U12_1: sheet U11/0CK-, sheet U12/ICk-C1, sheet U13/ICk-C2
NetC5_U13_1: sheet U12/0CK-, sheet U13/ICk-C1, sheet U14/ICk-C2
NetC5_U14_1: sheet U13/0CK-, sheet U14/ICk-C1, sheet U15/ICk-C2
NetC5_U17_1: sheet U16/0CK-, sheet U17/ICk-C1, sheet U18/ICk-C2
NetC5_U18_1: sheet U17/0CK-, sheet U18/ICk-C1, sheet U19/ICk-C2
NetC5_U19_1: sheet U18/0CK-, sheet U19/ICk-C1, sheet U20/ICk-C2
NetC5_U20_1: sheet U19/0CK-, sheet U20/ICk-C1, sheet U21/ICk-C2
NetC5_U21_1: sheet U20/0CK-, sheet U21/ICk-C1, sheet U22/ICk-C2
NetC5_U22_1: sheet U21/0CK-, sheet U22/ICk-C1, sheet U23/ICk-C2
NetC5_U23_1: sheet U22/0CK-, sheet U23/ICk-C1, sheet U24/ICk-C2
NetC5_U24_1: sheet U23/0CK-, sheet U24/ICk-C1, sheet U25/ICk-C2
NetC5_U25_1: sheet U24/0CK-, sheet U25/ICk-C1, sheet U26/ICk-C2
NetC5_U26_1: sheet U25/0CK-, sheet U26/ICk-C1, sheet U27/ICk-C2
NetC5_U27_1: sheet U26/0CK-, sheet U27/ICk-C1, sheet U28/ICk-C2
NetC5_U28_1: sheet U27/0CK-, sheet U28/ICk-C1
NetC6_U2_1: sheet U1/0CK+, sheet U2/ICk+C1, sheet U3/ICk+C2
NetC6_U3_1: sheet U2/0CK+, sheet U3/ICk+C1, sheet U4/ICk+C2
NetC6_U4_1: sheet U3/0CK+, sheet U4/ICk+C1, sheet U5/ICk+C2
NetC6_U5_1: sheet U4/0CK+, sheet U5/ICk+C1, sheet U6/ICk+C2
NetC6_U6_1: sheet U5/0CK+, sheet U6/ICk+C1, sheet U7/ICk+C2
NetC6_U7_1: sheet U6/0CK+, sheet U7/ICk+C1, sheet U8/ICk+C2
NetC6_U8_1: sheet U7/0CK+, sheet U8/ICk+C1, sheet U9/ICk+C2
NetC6_U9_1: sheet U8/0CK+, sheet U9/ICk+C1, sheet U10/ICk+C2
NetC6_U10_1: sheet U9/0CK+, sheet U10/ICk+C1, sheet U11/ICk+C2
NetC6_U11_1: sheet U10/0CK+, sheet U11/ICk+C1, sheet U12/ICk+C2
NetC6_U12_1: sheet U11/0CK+, sheet U12/ICk+C1, sheet U13/ICk+C2
NetC6_U13_1: sheet U12/0CK+, sheet U13/ICk+C1, sheet U14/ICk+C2
NetC6_U14_1: sheet U13/0CK+, sheet U14/ICk+C1, sheet U15/ICk+C2
NetC6_U17_1: sheet U16/0CK+, sheet U17/ICk+C1, sheet U18/ICk+C2
NetC6_U18_1: sheet U17/0CK+, sheet U18/ICk+C1, sheet U19/ICk+C2
NetC6_U19_1: sheet U18/0CK+, sheet U19/ICk+C1, sheet U20/ICk+C2
NetC6_U20_1: sheet U19/0CK+, sheet U20/ICk+C1, sheet U21/ICk+C2
NetC6_U21_1: sheet U20/0CK+, sheet U21/ICk+C1, sheet U22/ICk+C2
NetC6_U22_1: sheet U21/0CK+, sheet U22/ICk+C1, sheet U23/ICk+C2
NetC6_U23_1: sheet U22/0CK+, sheet U23/ICk+C1, sheet U24/ICk+C2
NetC6_U24_1: sheet U23/0CK+, sheet U24/ICk+C1, sheet U25/ICk+C2
NetC6_U25_1: sheet U24/0CK+, sheet U25/ICk+C1, sheet U26/ICk+C2
NetC6_U26_1: sheet U25/0CK+, sheet U26/ICk+C1, sheet U27/ICk+C2
NetC6_U27_1: sheet U26/0CK+, sheet U27/ICk+C1, sheet U28/ICk+C2
NetC6_U28_1: sheet U27/0CK+, sheet U28/ICk+C1
NetC7_U2_1: sheet U1/0Tx-, sheet U2/IRx-C1, sheet U3/IRx-C2
NetC7_U3_1: sheet U2/0Tx-, sheet U3/IRx-C1, sheet U4/IRx-C2
NetC7_U4_1: sheet U3/0Tx-, sheet U4/IRx-C1, sheet U5/IRx-C2
NetC7_U5_1: sheet U4/0Tx-, sheet U5/IRx-C1, sheet U6/IRx-C2
NetC7_U6_1: sheet U5/0Tx-, sheet U6/IRx-C1, sheet U7/IRx-C2
NetC7_U7_1: sheet U6/0Tx-, sheet U7/IRx-C1, sheet U8/IRx-C2
NetC7_U8_1: sheet U7/0Tx-, sheet U8/IRx-C1, sheet U9/IRx-C2
NetC7_U9_1: sheet U8/0Tx-, sheet U9/IRx-C1, sheet U10/IRx-C2
NetC7_U10_1: sheet U9/0Tx-, sheet U10/IRx-C1, sheet U11/IRx-C2
NetC7_U11_1: sheet U10/0Tx-, sheet U11/IRx-C1, sheet U12/IRx-C2
NetC7_U12_1: sheet U11/0Tx-, sheet U12/IRx-C1, sheet U13/IRx-C2
NetC7_U13_1: sheet U12/0Tx-, sheet U13/IRx-C1, sheet U14/IRx-C2
NetC7_U14_1: sheet U13/0Tx-, sheet U14/IRx-C1, sheet U15/IRx-C2
NetC7_U17_1: sheet U16/0Tx-, sheet U17/IRx-C1, sheet U18/IRx-C2
NetC7_U18_1: sheet U17/0Tx-, sheet U18/IRx-C1, sheet U19/IRx-C2
NetC7_U19_1: sheet U18/0Tx-, sheet U19/IRx-C1, sheet U20/IRx-C2
NetC7_U20_1: sheet U19/0Tx-, sheet U20/IRx-C1, sheet U21/IRx-C2
NetC7_U21_1: sheet U20/0Tx-, sheet U21/IRx-C1, sheet U22/IRx-C2
NetC7_U22_1: sheet U21/0Tx-, sheet U22/IRx-C1, sheet U23/IRx-C2
NetC7_U23_1: sheet U22/0Tx-, sheet U23/IRx-C1, sheet U24/IRx-C2
NetC7_U24_1: sheet U23/0Tx-, sheet U24/IRx-C1, sheet U25/IRx-C2
NetC7_U25_1: sheet U24/0Tx-, sheet U25/IRx-C1, sheet U26/IRx-C2
NetC7_U26_1: sheet U25/0Tx-, sheet U26/IRx-C1, sheet U27/IRx-C2
NetC7_U27_1: sheet U26/0Tx-, sheet U27/IRx-C1, sheet U28/IRx-C2
NetC7_U28_1: sheet U27/0Tx-, sheet U28/IRx-C1
NetC8_U2_1: sheet U1/0Tx+, sheet U2/IRx+C1, sheet U3/IRx+C2
NetC8_U3_1: sheet U2/0Tx+, sheet U3/IRx+C1, sheet U4/IRx+C2
NetC8_U4_1: sheet U3/0Tx+, sheet U4/IRx+C1, sheet U5/IRx+C2
NetC8_U5_1: sheet U4/0Tx+, sheet U5/IRx+C1, sheet U6/IRx+C2
NetC8_U6_1: sheet U5/0Tx+, sheet U6/IRx+C1, sheet U7/IRx+C2
NetC8_U7_1: sheet U6/0Tx+, sheet U7/IRx+C1, sheet U8/IRx+C2
NetC8_U8_1: sheet U7/0Tx+, sheet U8/IRx+C1, sheet U9/IRx+C2
NetC8_U9_1: sheet U8/0Tx+, sheet U9/IRx+C1, sheet U10/IRx+C2
NetC8_U10_1: sheet U9/0Tx+, sheet U10/IRx+C1, sheet U11/IRx+C2
NetC8_U11_1: sheet U10/0Tx+, sheet U11/IRx+C1, sheet U12/IRx+C2
NetC8_U12_1: sheet U11/0Tx+, sheet U12/IRx+C1, sheet U13/IRx+C2
NetC8_U13_1: sheet U12/0Tx+, sheet U13/IRx+C1, sheet U14/IRx+C2
NetC8_U14_1: sheet U13/0Tx+, sheet U14/IRx+C1, sheet U15/IRx+C2
NetC8_U17_1: sheet U16/0Tx+, sheet U17/IRx+C1, sheet U18/IRx+C2
NetC8_U18_1: sheet U17/0Tx+, sheet U18/IRx+C1, sheet U19/IRx+C2
NetC8_U19_1: sheet U18/0Tx+, sheet U19/IRx+C1, sheet U20/IRx+C2
NetC8_U20_1: sheet U19/0Tx+, sheet U20/IRx+C1, sheet U21/IRx+C2
NetC8_U21_1: sheet U20/0Tx+, sheet U21/IRx+C1, sheet U22/IRx+C2
NetC8_U22_1: sheet U21/0Tx+, sheet U22/IRx+C1, sheet U23/IRx+C2
NetC8_U23_1: sheet U22/0Tx+, sheet U23/IRx+C1, sheet U24/IRx+C2
NetC8_U24_1: sheet U23/0Tx+, sheet U24/IRx+C1, sheet U25/IRx+C2
NetC8_U25_1: sheet U24/0Tx+, sheet U25/IRx+C1, sheet U26/IRx+C2
NetC8_U26_1: sheet U25/0Tx+, sheet U26/IRx+C1, sheet U27/IRx+C2
NetC8_U27_1: sheet U26/0Tx+, sheet U27/IRx+C1, sheet U28/IRx+C2
NetC8_U28_1: sheet U27/0Tx+, sheet U28/IRx+C1
NetC18_1: port ITx0+, sheet U1/ITx+, sheet U_BF24/ITx0+
NetC21_1: port ITx0-, sheet U1/ITx-, sheet U_BF24/ITx0-
NetR2_2: R2.2 ; sheet U28/0CK-
NetR3_2: R3.2 ; sheet U28/0CK+

### Notes on the sheet
- 1
- 2
- 6
- 3
- 4
- 5
- 7
- 8
- 9
- 10
- 11
- 12
- 13
- 14
- 15
- 16
- 17
- 18
- 19
- 20
- 21
- 22
- 23
- 24
- 25
- 26
- 27
- 28
- Halil TEPEDELEN

## Sheet B9_HashBoard.SchDoc
size A4
Used 28 times, as channels U1, U2, U3, U4, U5, U6, U7, U8, U9, U10, U11, U12, U13, U14, U15, U16, U17, U18, U19, U20, U21, U22, U23, U24, U25, U26, U27, U28. Parts and nets are listed once, with the designators drawn on the sheet.
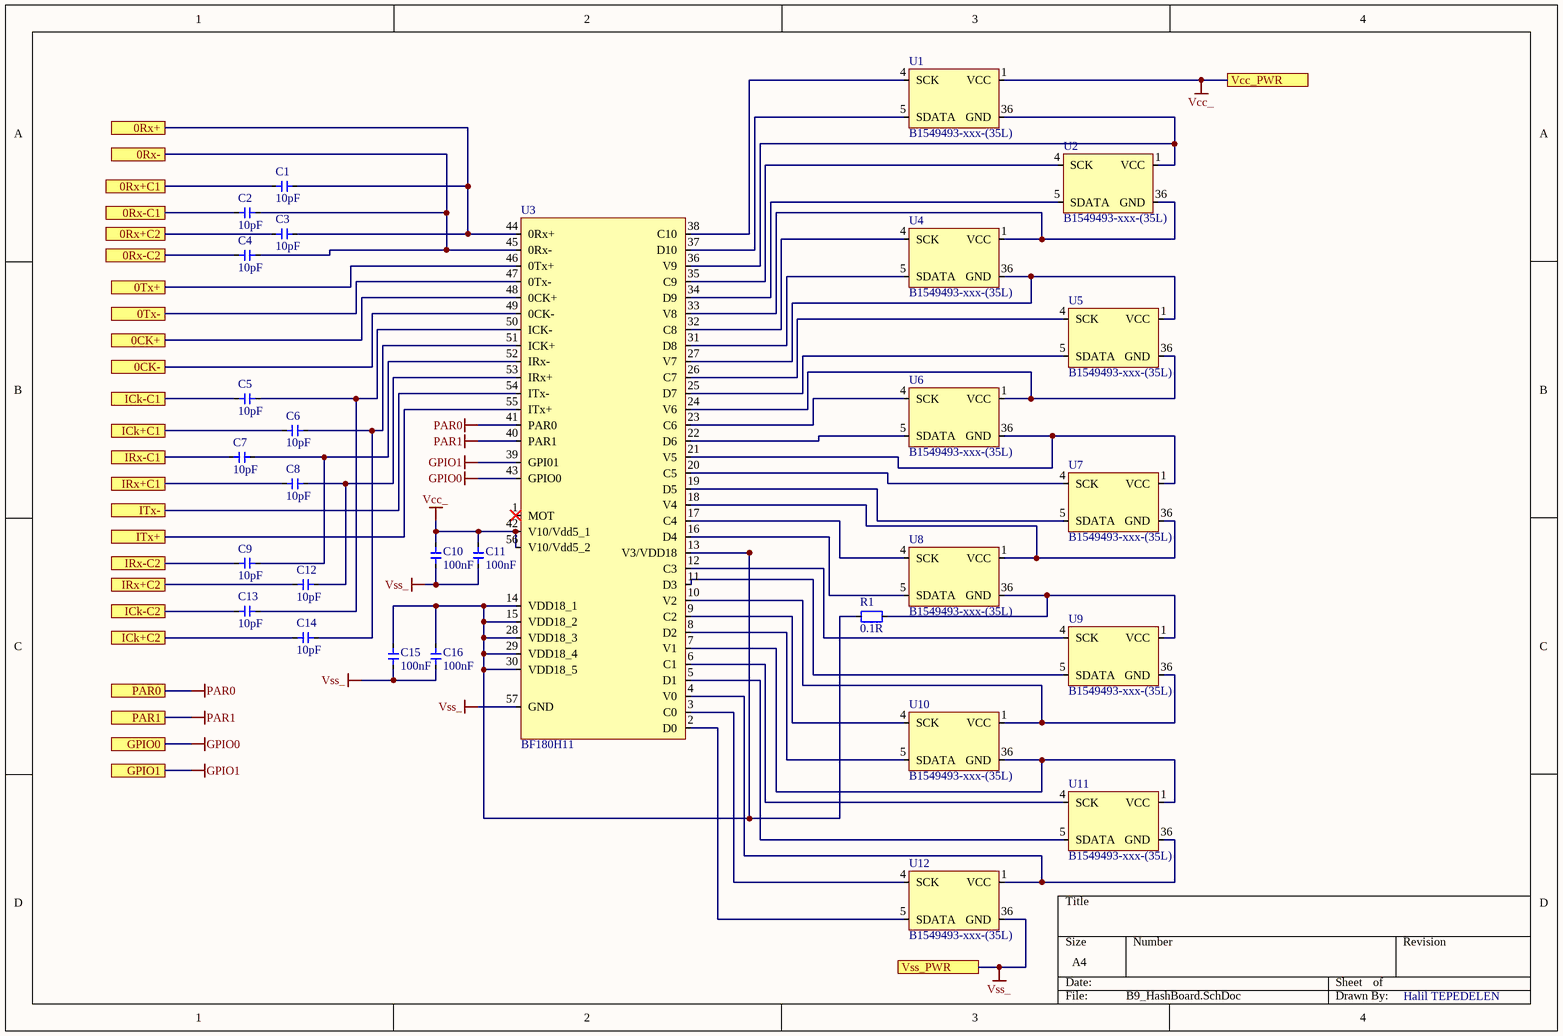
[diagram p6: B9_HashBoard.SchDoc]

### Parts
C1  10pF  [C-0402R]
C2  10pF  [C-0402R]
C3  10pF  [C-0402R]
C4  10pF  [C-0402R]
C5  10pF  [C-0402R]
C6  10pF  [C-0402R]
C7  10pF  [C-0402R]
C8  10pF  [C-0402R]
C9  10pF  [C-0402R]
C10  100nF  [C-0402R]
C11  100nF  [C-0402R]
C12  10pF  [C-0402R]
C13  10pF  [C-0402R]
C14  10pF  [C-0402R]
C15  100nF  [C-0402R]
C16  100nF  [C-0402R]
R1  0.1R  [R-0402R]
U1  B1549493-xxx-(35L)  [Bıtfury_Clarke_B1549493]
U2  B1549493-xxx-(35L)  [Bıtfury_Clarke_B1549493]
U3  BF180H11  [BF180H16]
U4  B1549493-xxx-(35L)  [Bıtfury_Clarke_B1549493]
U5  B1549493-xxx-(35L)  [Bıtfury_Clarke_B1549493]
U6  B1549493-xxx-(35L)  [Bıtfury_Clarke_B1549493]
U7  B1549493-xxx-(35L)  [Bıtfury_Clarke_B1549493]
U8  B1549493-xxx-(35L)  [Bıtfury_Clarke_B1549493]
U9  B1549493-xxx-(35L)  [Bıtfury_Clarke_B1549493]
U10  B1549493-xxx-(35L)  [Bıtfury_Clarke_B1549493]
U11  B1549493-xxx-(35L)  [Bıtfury_Clarke_B1549493]
U12  B1549493-xxx-(35L)  [Bıtfury_Clarke_B1549493]

### Ports
0CK+, 0CK-, 0Rx+, 0Rx+C1, 0Rx+C2, 0Rx-, 0Rx-C1, 0Rx-C2, 0Tx+, 0Tx-, GPIO0, GPIO1, ICk+C1, ICk+C2, ICk-C1, ICk-C2, IRx+C1, IRx+C2, IRx-C1, IRx-C2, ITx+, ITx-, PAR0, PAR1, Vcc_PWR, Vss_PWR

### Nets
GPIO0: U3.43(GPIO0) ; port GPIO0
GPIO1: U3.39(GPI01) ; port GPIO1
PAR0: U3.41(PAR0) ; port PAR0
PAR1: U3.40(PAR1) ; port PAR1
Vcc_: C10.2 C11.2 U1.1(VCC) U3.42(V10/Vdd5_1) U3.56(V10/Vdd5_2) ; port Vcc_PWR
Vss_: C10.1 C11.1 C15.1 C16.1 U3.57(GND) U12.36(GND) ; port Vss_PWR
0CK+: U3.48(0CK+) ; port 0CK+
0CK-: U3.49(0CK-) ; port 0CK-
0Rx+: C1.2 C3.2 U3.44(0Rx+) ; port 0Rx+
0Rx+C1: C1.1 ; port 0Rx+C1
0Rx+C2: C3.1 ; port 0Rx+C2
0Rx-: C2.2 C4.2 U3.45(0Rx-) ; port 0Rx-
0Rx-C1: C2.1 ; port 0Rx-C1
0Rx-C2: C4.1 ; port 0Rx-C2
0Tx+: U3.46(0Tx+) ; port 0Tx+
0Tx-: U3.47(0Tx-) ; port 0Tx-
ICk+C1: C6.1 ; port ICk+C1
ICk+C2: C14.1 ; port ICk+C2
ICk-C1: C5.1 ; port ICk-C1
ICk-C2: C13.1 ; port ICk-C2
IRx+C1: C8.1 ; port IRx+C1
IRx+C2: C12.1 ; port IRx+C2
IRx-C1: C7.1 ; port IRx-C1
IRx-C2: C9.1 ; port IRx-C2
ITx+: U3.55(ITx+) ; port ITx+
ITx-: U3.54(ITx-) ; port ITx-
NetC5_2: C5.2 C13.2 U3.50(ICK-)
NetC6_2: C6.2 C14.2 U3.51(ICK+)
NetC7_2: C7.2 C9.2 U3.52(IRx-)
NetC8_2: C8.2 C12.2 U3.53(IRx+)
NetC15_2: C15.2 C16.2 R1.1 U3.13(V3/VDD18) U3.14(VDD18_1) U3.15(VDD18_2) U3.28(VDD18_3) U3.29(VDD18_4) U3.30(VDD18_5)
NetR1_2: R1.2 U8.36(GND) U9.1(VCC)
NetU1_4: U1.4(SCK) U3.38(C10)
NetU1_5: U1.5(SDATA) U3.37(D10)
NetU1_36: U1.36(GND) U2.1(VCC) U3.36(V9)
NetU2_4: U2.4(SCK) U3.35(C9)
NetU2_5: U2.5(SDATA) U3.34(D9)
NetU2_36: U2.36(GND) U3.33(V8) U4.1(VCC)
NetU3_2: U3.2(D0) U12.5(SDATA)
NetU3_3: U3.3(C0) U12.4(SCK)
NetU3_4: U3.4(V0) U11.36(GND) U12.1(VCC)
NetU3_5: U3.5(D1) U11.5(SDATA)
NetU3_6: U3.6(C1) U11.4(SCK)
NetU3_7: U3.7(V1) U10.36(GND) U11.1(VCC)
NetU3_8: U3.8(D2) U10.5(SDATA)
NetU3_9: U3.9(C2) U10.4(SCK)
NetU3_10: U3.10(V2) U9.36(GND) U10.1(VCC)
NetU3_11: U3.11(D3) U9.5(SDATA)
NetU3_12: U3.12(C3) U9.4(SCK)
NetU3_16: U3.16(D4) U8.5(SDATA)
NetU3_17: U3.17(C4) U8.4(SCK)
NetU3_18: U3.18(V4) U7.36(GND) U8.1(VCC)
NetU3_19: U3.19(D5) U7.5(SDATA)
NetU3_20: U3.20(C5) U7.4(SCK)
NetU3_21: U3.21(V5) U6.36(GND) U7.1(VCC)
NetU3_22: U3.22(D6) U6.5(SDATA)
NetU3_23: U3.23(C6) U6.4(SCK)
NetU3_24: U3.24(V6) U5.36(GND) U6.1(VCC)
NetU3_25: U3.25(D7) U5.5(SDATA)
NetU3_26: U3.26(C7) U5.4(SCK)
NetU3_27: U3.27(V7) U4.36(GND) U5.1(VCC)
NetU3_31: U3.31(D8) U4.5(SDATA)
NetU3_32: U3.32(C8) U4.4(SCK)

Not connected (* = marked no-connect by the designer): U3 1(MOT)*

### Channels
U1: designators end in _U1; ports 0CK+=NetC6_U2_1 0CK-=NetC5_U2_1 0Rx+=NetC1_U1_2 0Rx+C1=NetC1_U1_1 0Rx+C2=NetC1_U2_1 0Rx-=NetC2_U1_2 0Rx-C1=NetC2_U1_1 0Rx-C2=NetC2_U2_1 0Tx+=NetC8_U2_1 0Tx-=NetC7_U2_1 GPIO0=GPIO0 GPIO1=GPIO1 ICk+C1=ICk+ ICk+C2=NetC14_U1_1 ICk-C1=ICk- ICk-C2=NetC13_U1_1 IRx+C1=IRx+ IRx+C2=NetC12_U1_1 IRx-C1=IRx- IRx-C2=NetC9_U1_1 ITx+=NetC18_1 ITx-=NetC21_1 PAR0=CHAIN- PAR1=CHAIN- Vcc_PWR=CHAIN- Vss_PWR=CHAIN-
U2: designators end in _U2; ports 0CK+=NetC6_U3_1 0CK-=NetC5_U3_1 0Rx+=NetC1_U2_2 0Rx+C1=NetC1_U2_1 0Rx+C2=NetC1_U3_1 0Rx-=NetC2_U2_2 0Rx-C1=NetC2_U2_1 0Rx-C2=NetC2_U3_1 0Tx+=NetC8_U3_1 0Tx-=NetC7_U3_1 GPIO0=GPIO0 GPIO1=GPIO1 ICk+C1=NetC6_U2_1 ICk+C2=ICk+ ICk-C1=NetC5_U2_1 ICk-C2=ICk- IRx+C1=NetC8_U2_1 IRx+C2=IRx+ IRx-C1=NetC7_U2_1 IRx-C2=IRx- ITx+=NetC1_U1_1 ITx-=NetC2_U1_1 PAR0=CHAIN- PAR1=CHAIN- Vcc_PWR=CHAIN- Vss_PWR=CHAIN-
U3: designators end in _U3; ports 0CK+=NetC6_U4_1 0CK-=NetC5_U4_1 0Rx+=NetC1_U3_2 0Rx+C1=NetC1_U3_1 0Rx+C2=NetC1_U4_1 0Rx-=NetC2_U3_2 0Rx-C1=NetC2_U3_1 0Rx-C2=NetC2_U4_1 0Tx+=NetC8_U4_1 0Tx-=NetC7_U4_1 GPIO0=GPIO0 GPIO1=GPIO1 ICk+C1=NetC6_U3_1 ICk+C2=NetC6_U2_1 ICk-C1=NetC5_U3_1 ICk-C2=NetC5_U2_1 IRx+C1=NetC8_U3_1 IRx+C2=NetC8_U2_1 IRx-C1=NetC7_U3_1 IRx-C2=NetC7_U2_1 ITx+=NetC1_U2_1 ITx-=NetC2_U2_1 PAR0=CHAIN- PAR1=CHAIN- Vcc_PWR=CHAIN- Vss_PWR=CHAIN-
U4: designators end in _U4; ports 0CK+=NetC6_U5_1 0CK-=NetC5_U5_1 0Rx+=NetC1_U4_2 0Rx+C1=NetC1_U4_1 0Rx+C2=NetC1_U5_1 0Rx-=NetC2_U4_2 0Rx-C1=NetC2_U4_1 0Rx-C2=NetC2_U5_1 0Tx+=NetC8_U5_1 0Tx-=NetC7_U5_1 GPIO0=GPIO0 GPIO1=GPIO1 ICk+C1=NetC6_U4_1 ICk+C2=NetC6_U3_1 ICk-C1=NetC5_U4_1 ICk-C2=NetC5_U3_1 IRx+C1=NetC8_U4_1 IRx+C2=NetC8_U3_1 IRx-C1=NetC7_U4_1 IRx-C2=NetC7_U3_1 ITx+=NetC1_U3_1 ITx-=NetC2_U3_1 PAR0=CHAIN- PAR1=CHAIN- Vcc_PWR=CHAIN- Vss_PWR=CHAIN-
U5: designators end in _U5; ports 0CK+=NetC6_U6_1 0CK-=NetC5_U6_1 0Rx+=NetC1_U5_2 0Rx+C1=NetC1_U5_1 0Rx+C2=NetC1_U6_1 0Rx-=NetC2_U5_2 0Rx-C1=NetC2_U5_1 0Rx-C2=NetC2_U6_1 0Tx+=NetC8_U6_1 0Tx-=NetC7_U6_1 GPIO0=GPIO0 GPIO1=GPIO1 ICk+C1=NetC6_U5_1 ICk+C2=NetC6_U4_1 ICk-C1=NetC5_U5_1 ICk-C2=NetC5_U4_1 IRx+C1=NetC8_U5_1 IRx+C2=NetC8_U4_1 IRx-C1=NetC7_U5_1 IRx-C2=NetC7_U4_1 ITx+=NetC1_U4_1 ITx-=NetC2_U4_1 PAR0=CHAIN- PAR1=CHAIN- Vcc_PWR=CHAIN- Vss_PWR=CHAIN-
U6: designators end in _U6; ports 0CK+=NetC6_U7_1 0CK-=NetC5_U7_1 0Rx+=NetC1_U6_2 0Rx+C1=NetC1_U6_1 0Rx+C2=NetC1_U7_1 0Rx-=NetC2_U6_2 0Rx-C1=NetC2_U6_1 0Rx-C2=NetC2_U7_1 0Tx+=NetC8_U7_1 0Tx-=NetC7_U7_1 GPIO0=GPIO0 GPIO1=GPIO1 ICk+C1=NetC6_U6_1 ICk+C2=NetC6_U5_1 ICk-C1=NetC5_U6_1 ICk-C2=NetC5_U5_1 IRx+C1=NetC8_U6_1 IRx+C2=NetC8_U5_1 IRx-C1=NetC7_U6_1 IRx-C2=NetC7_U5_1 ITx+=NetC1_U5_1 ITx-=NetC2_U5_1 PAR0=CHAIN- PAR1=CHAIN- Vcc_PWR=CHAIN- Vss_PWR=CHAIN-
U7: designators end in _U7; ports 0CK+=NetC6_U8_1 0CK-=NetC5_U8_1 0Rx+=NetC1_U7_2 0Rx+C1=NetC1_U7_1 0Rx+C2=NetC1_U8_1 0Rx-=NetC2_U7_2 0Rx-C1=NetC2_U7_1 0Rx-C2=NetC2_U8_1 0Tx+=NetC8_U8_1 0Tx-=NetC7_U8_1 GPIO0=GPIO0 GPIO1=GPIO1 ICk+C1=NetC6_U7_1 ICk+C2=NetC6_U6_1 ICk-C1=NetC5_U7_1 ICk-C2=NetC5_U6_1 IRx+C1=NetC8_U7_1 IRx+C2=NetC8_U6_1 IRx-C1=NetC7_U7_1 IRx-C2=NetC7_U6_1 ITx+=NetC1_U6_1 ITx-=NetC2_U6_1 PAR0=CHAIN- PAR1=CHAIN- Vcc_PWR=CHAIN- Vss_PWR=CHAIN-
U8: designators end in _U8; ports 0CK+=NetC6_U9_1 0CK-=NetC5_U9_1 0Rx+=NetC1_U8_2 0Rx+C1=NetC1_U8_1 0Rx+C2=NetC1_U9_1 0Rx-=NetC2_U8_2 0Rx-C1=NetC2_U8_1 0Rx-C2=NetC2_U9_1 0Tx+=NetC8_U9_1 0Tx-=NetC7_U9_1 GPIO0=GPIO0 GPIO1=GPIO1 ICk+C1=NetC6_U8_1 ICk+C2=NetC6_U7_1 ICk-C1=NetC5_U8_1 ICk-C2=NetC5_U7_1 IRx+C1=NetC8_U8_1 IRx+C2=NetC8_U7_1 IRx-C1=NetC7_U8_1 IRx-C2=NetC7_U7_1 ITx+=NetC1_U7_1 ITx-=NetC2_U7_1 PAR0=CHAIN- PAR1=CHAIN- Vcc_PWR=CHAIN- Vss_PWR=CHAIN-
U9: designators end in _U9; ports 0CK+=NetC6_U10_1 0CK-=NetC5_U10_1 0Rx+=NetC1_U9_2 0Rx+C1=NetC1_U9_1 0Rx+C2=NetC1_U10_1 0Rx-=NetC2_U9_2 0Rx-C1=NetC2_U9_1 0Rx-C2=NetC2_U10_1 0Tx+=NetC8_U10_1 0Tx-=NetC7_U10_1 GPIO0=GPIO0 GPIO1=GPIO1 ICk+C1=NetC6_U9_1 ICk+C2=NetC6_U8_1 ICk-C1=NetC5_U9_1 ICk-C2=NetC5_U8_1 IRx+C1=NetC8_U9_1 IRx+C2=NetC8_U8_1 IRx-C1=NetC7_U9_1 IRx-C2=NetC7_U8_1 ITx+=NetC1_U8_1 ITx-=NetC2_U8_1 PAR0=CHAIN- PAR1=CHAIN- Vcc_PWR=CHAIN- Vss_PWR=CHAIN-
U10: designators end in _U10; ports 0CK+=NetC6_U11_1 0CK-=NetC5_U11_1 0Rx+=NetC1_U10_2 0Rx+C1=NetC1_U10_1 0Rx+C2=NetC1_U11_1 0Rx-=NetC2_U10_2 0Rx-C1=NetC2_U10_1 0Rx-C2=NetC2_U11_1 0Tx+=NetC8_U11_1 0Tx-=NetC7_U11_1 GPIO0=GPIO0 GPIO1=GPIO1 ICk+C1=NetC6_U10_1 ICk+C2=NetC6_U9_1 ICk-C1=NetC5_U10_1 ICk-C2=NetC5_U9_1 IRx+C1=NetC8_U10_1 IRx+C2=NetC8_U9_1 IRx-C1=NetC7_U10_1 IRx-C2=NetC7_U9_1 ITx+=NetC1_U9_1 ITx-=NetC2_U9_1 PAR0=CHAIN- PAR1=CHAIN- Vcc_PWR=CHAIN- Vss_PWR=CHAIN-
U11: designators end in _U11; ports 0CK+=NetC6_U12_1 0CK-=NetC5_U12_1 0Rx+=NetC1_U11_2 0Rx+C1=NetC1_U11_1 0Rx+C2=NetC1_U12_1 0Rx-=NetC2_U11_2 0Rx-C1=NetC2_U11_1 0Rx-C2=NetC2_U12_1 0Tx+=NetC8_U12_1 0Tx-=NetC7_U12_1 GPIO0=GPIO0 GPIO1=GPIO1 ICk+C1=NetC6_U11_1 ICk+C2=NetC6_U10_1 ICk-C1=NetC5_U11_1 ICk-C2=NetC5_U10_1 IRx+C1=NetC8_U11_1 IRx+C2=NetC8_U10_1 IRx-C1=NetC7_U11_1 IRx-C2=NetC7_U10_1 ITx+=NetC1_U10_1 ITx-=NetC2_U10_1 PAR0=CHAIN- PAR1=CHAIN- Vcc_PWR=CHAIN- Vss_PWR=CHAIN-
U12: designators end in _U12; ports 0CK+=NetC6_U13_1 0CK-=NetC5_U13_1 0Rx+=NetC1_U12_2 0Rx+C1=NetC1_U12_1 0Rx+C2=NetC1_U13_1 0Rx-=NetC2_U12_2 0Rx-C1=NetC2_U12_1 0Rx-C2=NetC2_U13_1 0Tx+=NetC8_U13_1 0Tx-=NetC7_U13_1 GPIO0=GPIO0 GPIO1=GPIO1 ICk+C1=NetC6_U12_1 ICk+C2=NetC6_U11_1 ICk-C1=NetC5_U12_1 ICk-C2=NetC5_U11_1 IRx+C1=NetC8_U12_1 IRx+C2=NetC8_U11_1 IRx-C1=NetC7_U12_1 IRx-C2=NetC7_U11_1 ITx+=NetC1_U11_1 ITx-=NetC2_U11_1 PAR0=CHAIN- PAR1=CHAIN- Vcc_PWR=CHAIN- Vss_PWR=CHAIN-
U13: designators end in _U13; ports 0CK+=NetC6_U14_1 0CK-=NetC5_U14_1 0Rx+=NetC1_U13_2 0Rx+C1=NetC1_U13_1 0Rx+C2=NetC1_U14_1 0Rx-=NetC2_U13_2 0Rx-C1=NetC2_U13_1 0Rx-C2=NetC2_U14_1 0Tx+=NetC8_U14_1 0Tx-=NetC7_U14_1 GPIO0=GPIO0 GPIO1=GPIO1 ICk+C1=NetC6_U13_1 ICk+C2=NetC6_U12_1 ICk-C1=NetC5_U13_1 ICk-C2=NetC5_U12_1 IRx+C1=NetC8_U13_1 IRx+C2=NetC8_U12_1 IRx-C1=NetC7_U13_1 IRx-C2=NetC7_U12_1 ITx+=NetC1_U12_1 ITx-=NetC2_U12_1 PAR0=CHAIN- PAR1=CHAIN- Vcc_PWR=CHAIN- Vss_PWR=CHAIN-
U14: designators end in _U14; ports 0CK+=10 0CK-=12 0Rx+=NetC1_U14_2 0Rx+C1=NetC1_U14_1 0Rx+C2=7 0Rx-=NetC2_U14_2 0Rx-C1=NetC2_U14_1 0Rx-C2=5 0Tx+=2 0Tx-=4 GPIO0=GPIO0 GPIO1=GPIO1 ICk+C1=NetC6_U14_1 ICk+C2=NetC6_U13_1 ICk-C1=NetC5_U14_1 ICk-C2=NetC5_U13_1 IRx+C1=NetC8_U14_1 IRx+C2=NetC8_U13_1 IRx-C1=NetC7_U14_1 IRx-C2=NetC7_U13_1 ITx+=NetC1_U13_1 ITx-=NetC2_U13_1 PAR0=CHAIN- PAR1=CHAIN- Vcc_PWR=CHAIN- Vss_PWR=CHAIN-
U15: designators end in _U15; ports 0CK+=9 0CK-=11 0Rx+=NetC1_U15_2 0Rx+C1=7 0Rx+C2=8 0Rx-=NetC2_U15_2 0Rx-C1=5 0Rx-C2=6 0Tx+=1 0Tx-=3 GPIO0=GPIO0 GPIO1=GPIO1 ICk+C1=10 ICk+C2=NetC6_U14_1 ICk-C1=12 ICk-C2=NetC5_U14_1 IRx+C1=2 IRx+C2=NetC8_U14_1 IRx-C1=4 IRx-C2=NetC7_U14_1 ITx+=NetC1_U14_1 ITx-=NetC2_U14_1 PAR0=CHAIN- PAR1=CHAIN- Vcc_PWR=CHAIN- Vss_PWR=CHAIN-
U16: designators end in _U16; ports 0CK+=NetC6_U17_1 0CK-=NetC5_U17_1 0Rx+=NetC1_U16_2 0Rx+C1=NetC1_U16_1 0Rx+C2=NetC1_U17_1 0Rx-=NetC2_U16_2 0Rx-C1=6 0Rx-C2=8 0Tx+=NetC8_U17_1 0Tx-=NetC7_U17_1 GPIO0=GPIO0 GPIO1=GPIO1 ICk+C1=9 ICk+C2=10 ICk-C1=11 ICk-C2=12 IRx+C1=1 IRx+C2=2 IRx-C1=3 IRx-C2=4 ITx+=7 ITx-=5 PAR0=CHAIN- PAR1=CHAIN- Vcc_PWR=CHAIN- Vss_PWR=CHAIN-
U17: designators end in _U17; ports 0CK+=NetC6_U18_1 0CK-=NetC5_U18_1 0Rx+=NetC1_U17_2 0Rx+C1=NetC1_U17_1 0Rx+C2=NetC1_U18_1 0Rx-=NetC2_U17_2 0Rx-C1=8 0Rx-C2=NetC2_U18_1 0Tx+=NetC8_U18_1 0Tx-=NetC7_U18_1 GPIO0=GPIO0 GPIO1=GPIO1 ICk+C1=NetC6_U17_1 ICk+C2=9 ICk-C1=NetC5_U17_1 ICk-C2=11 IRx+C1=NetC8_U17_1 IRx+C2=1 IRx-C1=NetC7_U17_1 IRx-C2=3 ITx+=NetC1_U16_1 ITx-=6 PAR0=CHAIN- PAR1=CHAIN- Vcc_PWR=CHAIN- Vss_PWR=CHAIN-
U18: designators end in _U18; ports 0CK+=NetC6_U19_1 0CK-=NetC5_U19_1 0Rx+=NetC1_U18_2 0Rx+C1=NetC1_U18_1 0Rx+C2=NetC1_U19_1 0Rx-=NetC2_U18_2 0Rx-C1=NetC2_U18_1 0Rx-C2=NetC2_U19_1 0Tx+=NetC8_U19_1 0Tx-=NetC7_U19_1 GPIO0=GPIO0 GPIO1=GPIO1 ICk+C1=NetC6_U18_1 ICk+C2=NetC6_U17_1 ICk-C1=NetC5_U18_1 ICk-C2=NetC5_U17_1 IRx+C1=NetC8_U18_1 IRx+C2=NetC8_U17_1 IRx-C1=NetC7_U18_1 IRx-C2=NetC7_U17_1 ITx+=NetC1_U17_1 ITx-=8 PAR0=CHAIN- PAR1=CHAIN- Vcc_PWR=CHAIN- Vss_PWR=CHAIN-
U19: designators end in _U19; ports 0CK+=NetC6_U20_1 0CK-=NetC5_U20_1 0Rx+=NetC1_U19_2 0Rx+C1=NetC1_U19_1 0Rx+C2=NetC1_U20_1 0Rx-=NetC2_U19_2 0Rx-C1=NetC2_U19_1 0Rx-C2=NetC2_U20_1 0Tx+=NetC8_U20_1 0Tx-=NetC7_U20_1 GPIO0=GPIO0 GPIO1=GPIO1 ICk+C1=NetC6_U19_1 ICk+C2=NetC6_U18_1 ICk-C1=NetC5_U19_1 ICk-C2=NetC5_U18_1 IRx+C1=NetC8_U19_1 IRx+C2=NetC8_U18_1 IRx-C1=NetC7_U19_1 IRx-C2=NetC7_U18_1 ITx+=NetC1_U18_1 ITx-=NetC2_U18_1 PAR0=CHAIN- PAR1=CHAIN- Vcc_PWR=CHAIN- Vss_PWR=CHAIN-
U20: designators end in _U20; ports 0CK+=NetC6_U21_1 0CK-=NetC5_U21_1 0Rx+=NetC1_U20_2 0Rx+C1=NetC1_U20_1 0Rx+C2=NetC1_U21_1 0Rx-=NetC2_U20_2 0Rx-C1=NetC2_U20_1 0Rx-C2=NetC2_U21_1 0Tx+=NetC8_U21_1 0Tx-=NetC7_U21_1 GPIO0=GPIO0 GPIO1=GPIO1 ICk+C1=NetC6_U20_1 ICk+C2=NetC6_U19_1 ICk-C1=NetC5_U20_1 ICk-C2=NetC5_U19_1 IRx+C1=NetC8_U20_1 IRx+C2=NetC8_U19_1 IRx-C1=NetC7_U20_1 IRx-C2=NetC7_U19_1 ITx+=NetC1_U19_1 ITx-=NetC2_U19_1 PAR0=CHAIN- PAR1=CHAIN- Vcc_PWR=CHAIN- Vss_PWR=CHAIN-
U21: designators end in _U21; ports 0CK+=NetC6_U22_1 0CK-=NetC5_U22_1 0Rx+=NetC1_U21_2 0Rx+C1=NetC1_U21_1 0Rx+C2=NetC1_U22_1 0Rx-=NetC2_U21_2 0Rx-C1=NetC2_U21_1 0Rx-C2=NetC2_U22_1 0Tx+=NetC8_U22_1 0Tx-=NetC7_U22_1 GPIO0=GPIO0 GPIO1=GPIO1 ICk+C1=NetC6_U21_1 ICk+C2=NetC6_U20_1 ICk-C1=NetC5_U21_1 ICk-C2=NetC5_U20_1 IRx+C1=NetC8_U21_1 IRx+C2=NetC8_U20_1 IRx-C1=NetC7_U21_1 IRx-C2=NetC7_U20_1 ITx+=NetC1_U20_1 ITx-=NetC2_U20_1 PAR0=CHAIN- PAR1=CHAIN- Vcc_PWR=CHAIN- Vss_PWR=CHAIN-
U22: designators end in _U22; ports 0CK+=NetC6_U23_1 0CK-=NetC5_U23_1 0Rx+=NetC1_U22_2 0Rx+C1=NetC1_U22_1 0Rx+C2=NetC1_U23_1 0Rx-=NetC2_U22_2 0Rx-C1=NetC2_U22_1 0Rx-C2=NetC2_U23_1 0Tx+=NetC8_U23_1 0Tx-=NetC7_U23_1 GPIO0=GPIO0 GPIO1=GPIO1 ICk+C1=NetC6_U22_1 ICk+C2=NetC6_U21_1 ICk-C1=NetC5_U22_1 ICk-C2=NetC5_U21_1 IRx+C1=NetC8_U22_1 IRx+C2=NetC8_U21_1 IRx-C1=NetC7_U22_1 IRx-C2=NetC7_U21_1 ITx+=NetC1_U21_1 ITx-=NetC2_U21_1 PAR0=CHAIN- PAR1=CHAIN- Vcc_PWR=CHAIN- Vss_PWR=CHAIN-
U23: designators end in _U23; ports 0CK+=NetC6_U24_1 0CK-=NetC5_U24_1 0Rx+=NetC1_U23_2 0Rx+C1=NetC1_U23_1 0Rx+C2=NetC1_U24_1 0Rx-=NetC2_U23_2 0Rx-C1=NetC2_U23_1 0Rx-C2=NetC2_U24_1 0Tx+=NetC8_U24_1 0Tx-=NetC7_U24_1 GPIO0=GPIO0 GPIO1=GPIO1 ICk+C1=NetC6_U23_1 ICk+C2=NetC6_U22_1 ICk-C1=NetC5_U23_1 ICk-C2=NetC5_U22_1 IRx+C1=NetC8_U23_1 IRx+C2=NetC8_U22_1 IRx-C1=NetC7_U23_1 IRx-C2=NetC7_U22_1 ITx+=NetC1_U22_1 ITx-=NetC2_U22_1 PAR0=CHAIN- PAR1=CHAIN- Vcc_PWR=CHAIN- Vss_PWR=CHAIN-
U24: designators end in _U24; ports 0CK+=NetC6_U25_1 0CK-=NetC5_U25_1 0Rx+=NetC1_U24_2 0Rx+C1=NetC1_U24_1 0Rx+C2=NetC1_U25_1 0Rx-=NetC2_U24_2 0Rx-C1=NetC2_U24_1 0Rx-C2=NetC2_U25_1 0Tx+=NetC8_U25_1 0Tx-=NetC7_U25_1 GPIO0=GPIO0 GPIO1=GPIO1 ICk+C1=NetC6_U24_1 ICk+C2=NetC6_U23_1 ICk-C1=NetC5_U24_1 ICk-C2=NetC5_U23_1 IRx+C1=NetC8_U24_1 IRx+C2=NetC8_U23_1 IRx-C1=NetC7_U24_1 IRx-C2=NetC7_U23_1 ITx+=NetC1_U23_1 ITx-=NetC2_U23_1 PAR0=CHAIN- PAR1=CHAIN- Vcc_PWR=CHAIN- Vss_PWR=CHAIN-
U25: designators end in _U25; ports 0CK+=NetC6_U26_1 0CK-=NetC5_U26_1 0Rx+=NetC1_U25_2 0Rx+C1=NetC1_U25_1 0Rx+C2=NetC1_U26_1 0Rx-=NetC2_U25_2 0Rx-C1=NetC2_U25_1 0Rx-C2=NetC2_U26_1 0Tx+=NetC8_U26_1 0Tx-=NetC7_U26_1 GPIO0=GPIO0 GPIO1=GPIO1 ICk+C1=NetC6_U25_1 ICk+C2=NetC6_U24_1 ICk-C1=NetC5_U25_1 ICk-C2=NetC5_U24_1 IRx+C1=NetC8_U25_1 IRx+C2=NetC8_U24_1 IRx-C1=NetC7_U25_1 IRx-C2=NetC7_U24_1 ITx+=NetC1_U24_1 ITx-=NetC2_U24_1 PAR0=CHAIN- PAR1=CHAIN- Vcc_PWR=CHAIN- Vss_PWR=CHAIN-
U26: designators end in _U26; ports 0CK+=NetC6_U27_1 0CK-=NetC5_U27_1 0Rx+=NetC1_U26_2 0Rx+C1=NetC1_U26_1 0Rx+C2=NetC1_U27_1 0Rx-=NetC2_U26_2 0Rx-C1=NetC2_U26_1 0Rx-C2=NetC2_U27_1 0Tx+=NetC8_U27_1 0Tx-=NetC7_U27_1 GPIO0=GPIO0 GPIO1=GPIO1 ICk+C1=NetC6_U26_1 ICk+C2=NetC6_U25_1 ICk-C1=NetC5_U26_1 ICk-C2=NetC5_U25_1 IRx+C1=NetC8_U26_1 IRx+C2=NetC8_U25_1 IRx-C1=NetC7_U26_1 IRx-C2=NetC7_U25_1 ITx+=NetC1_U25_1 ITx-=NetC2_U25_1 PAR0=CHAIN- PAR1=CHAIN- Vcc_PWR=CHAIN- Vss_PWR=CHAIN-
U27: designators end in _U27; ports 0CK+=NetC6_U28_1 0CK-=NetC5_U28_1 0Rx+=NetC1_U27_2 0Rx+C1=NetC1_U27_1 0Rx+C2=NetC1_U28_1 0Rx-=NetC2_U27_2 0Rx-C1=NetC2_U27_1 0Rx-C2=NetC2_U28_1 0Tx+=NetC8_U28_1 0Tx-=NetC7_U28_1 GPIO0=GPIO0 GPIO1=GPIO1 ICk+C1=NetC6_U27_1 ICk+C2=NetC6_U26_1 ICk-C1=NetC5_U27_1 ICk-C2=NetC5_U26_1 IRx+C1=NetC8_U27_1 IRx+C2=NetC8_U26_1 IRx-C1=NetC7_U27_1 IRx-C2=NetC7_U26_1 ITx+=NetC1_U26_1 ITx-=NetC2_U26_1 PAR0=CHAIN- PAR1=CHAIN- Vcc_PWR=CHAIN- Vss_PWR=CHAIN-
U28: designators end in _U28; ports 0CK+=NetR3_2 0CK-=NetR2_2 0Rx+=NetC1_U28_2 0Rx+C1=NetC1_U28_1 0Rx+C2=NetC3_U28_1 0Rx-=NetC2_U28_2 0Rx-C1=NetC2_U28_1 0Rx-C2=NetC4_U28_1 0Tx+=NetU3_U28_46 0Tx-=NetU3_U28_47 GPIO0=GPIO0 GPIO1=GPIO1 ICk+C1=NetC6_U28_1 ICk+C2=NetC6_U27_1 ICk-C1=NetC5_U28_1 ICk-C2=NetC5_U27_1 IRx+C1=NetC8_U28_1 IRx+C2=NetC8_U27_1 IRx-C1=NetC7_U28_1 IRx-C2=NetC7_U27_1 ITx+=NetC1_U27_1 ITx-=NetC2_U27_1 PAR0=CHAIN- PAR1=CHAIN- Vcc_PWR=CHAIN- Vss_PWR=CHAIN-

### Notes on the sheet
- Halil TEPEDELEN